# EAGLE design smarty09 (EAGLE 6.5.0)
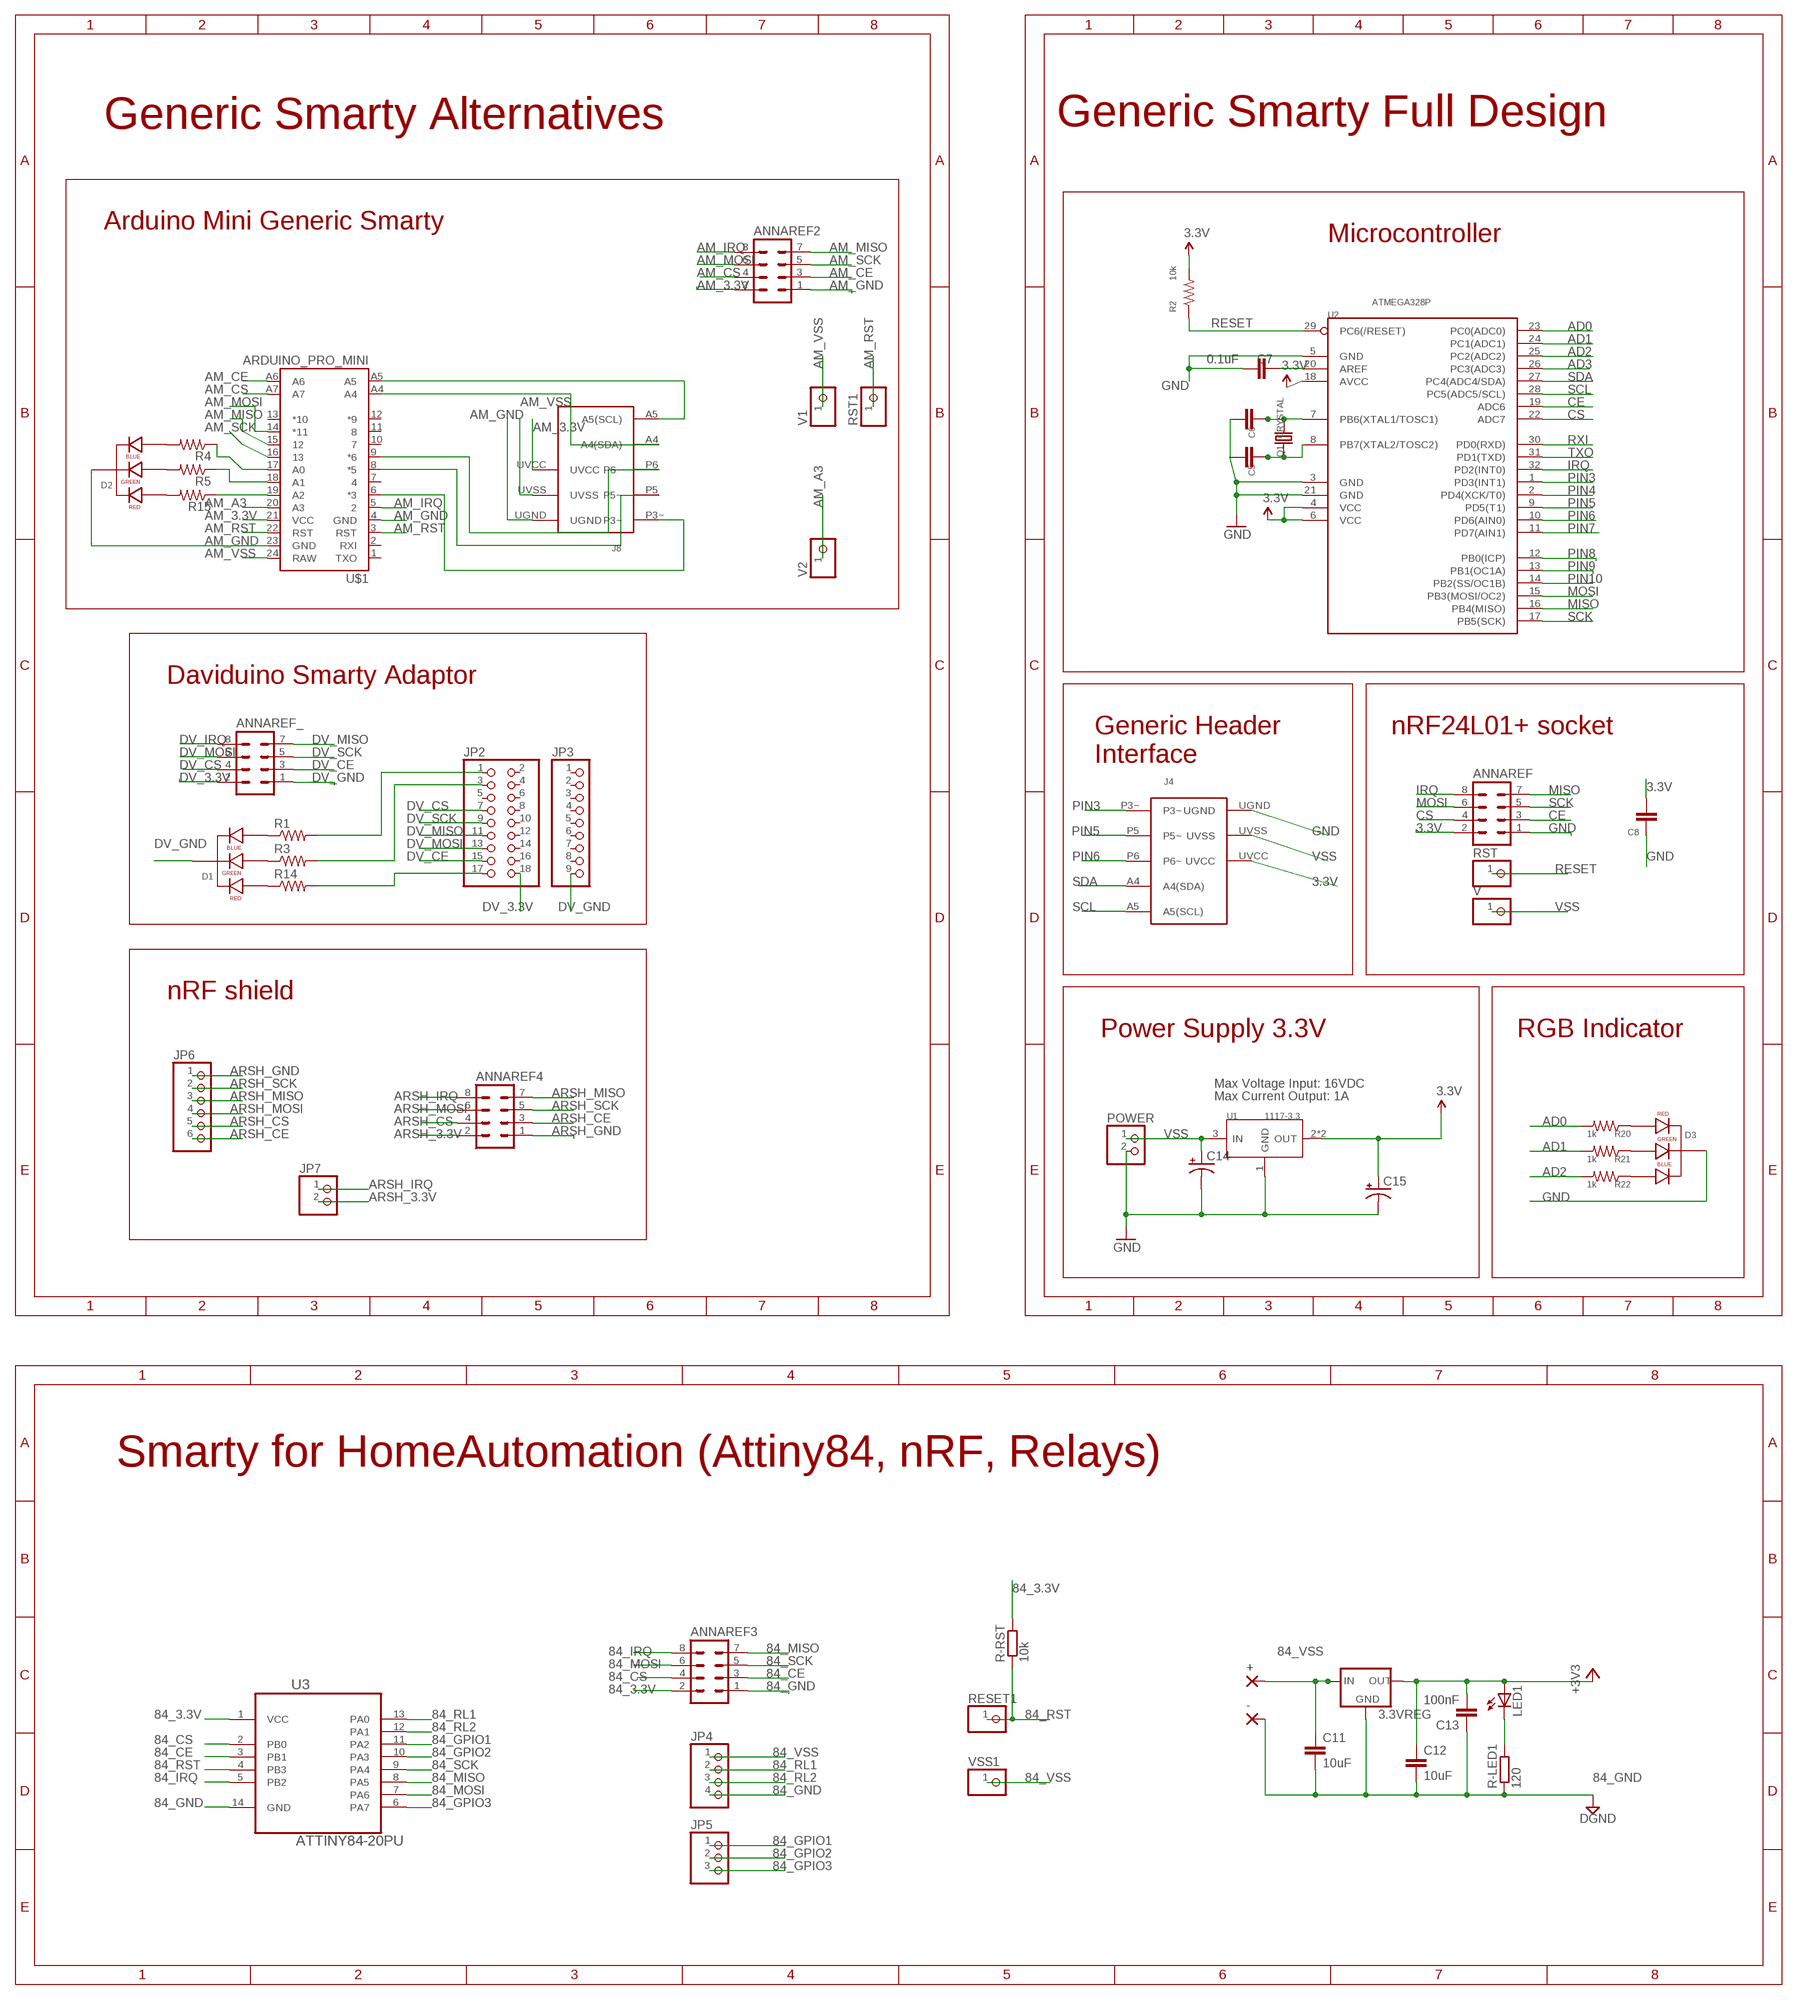
[diagram p0: schematic, sheet 1, part 1 of 2]
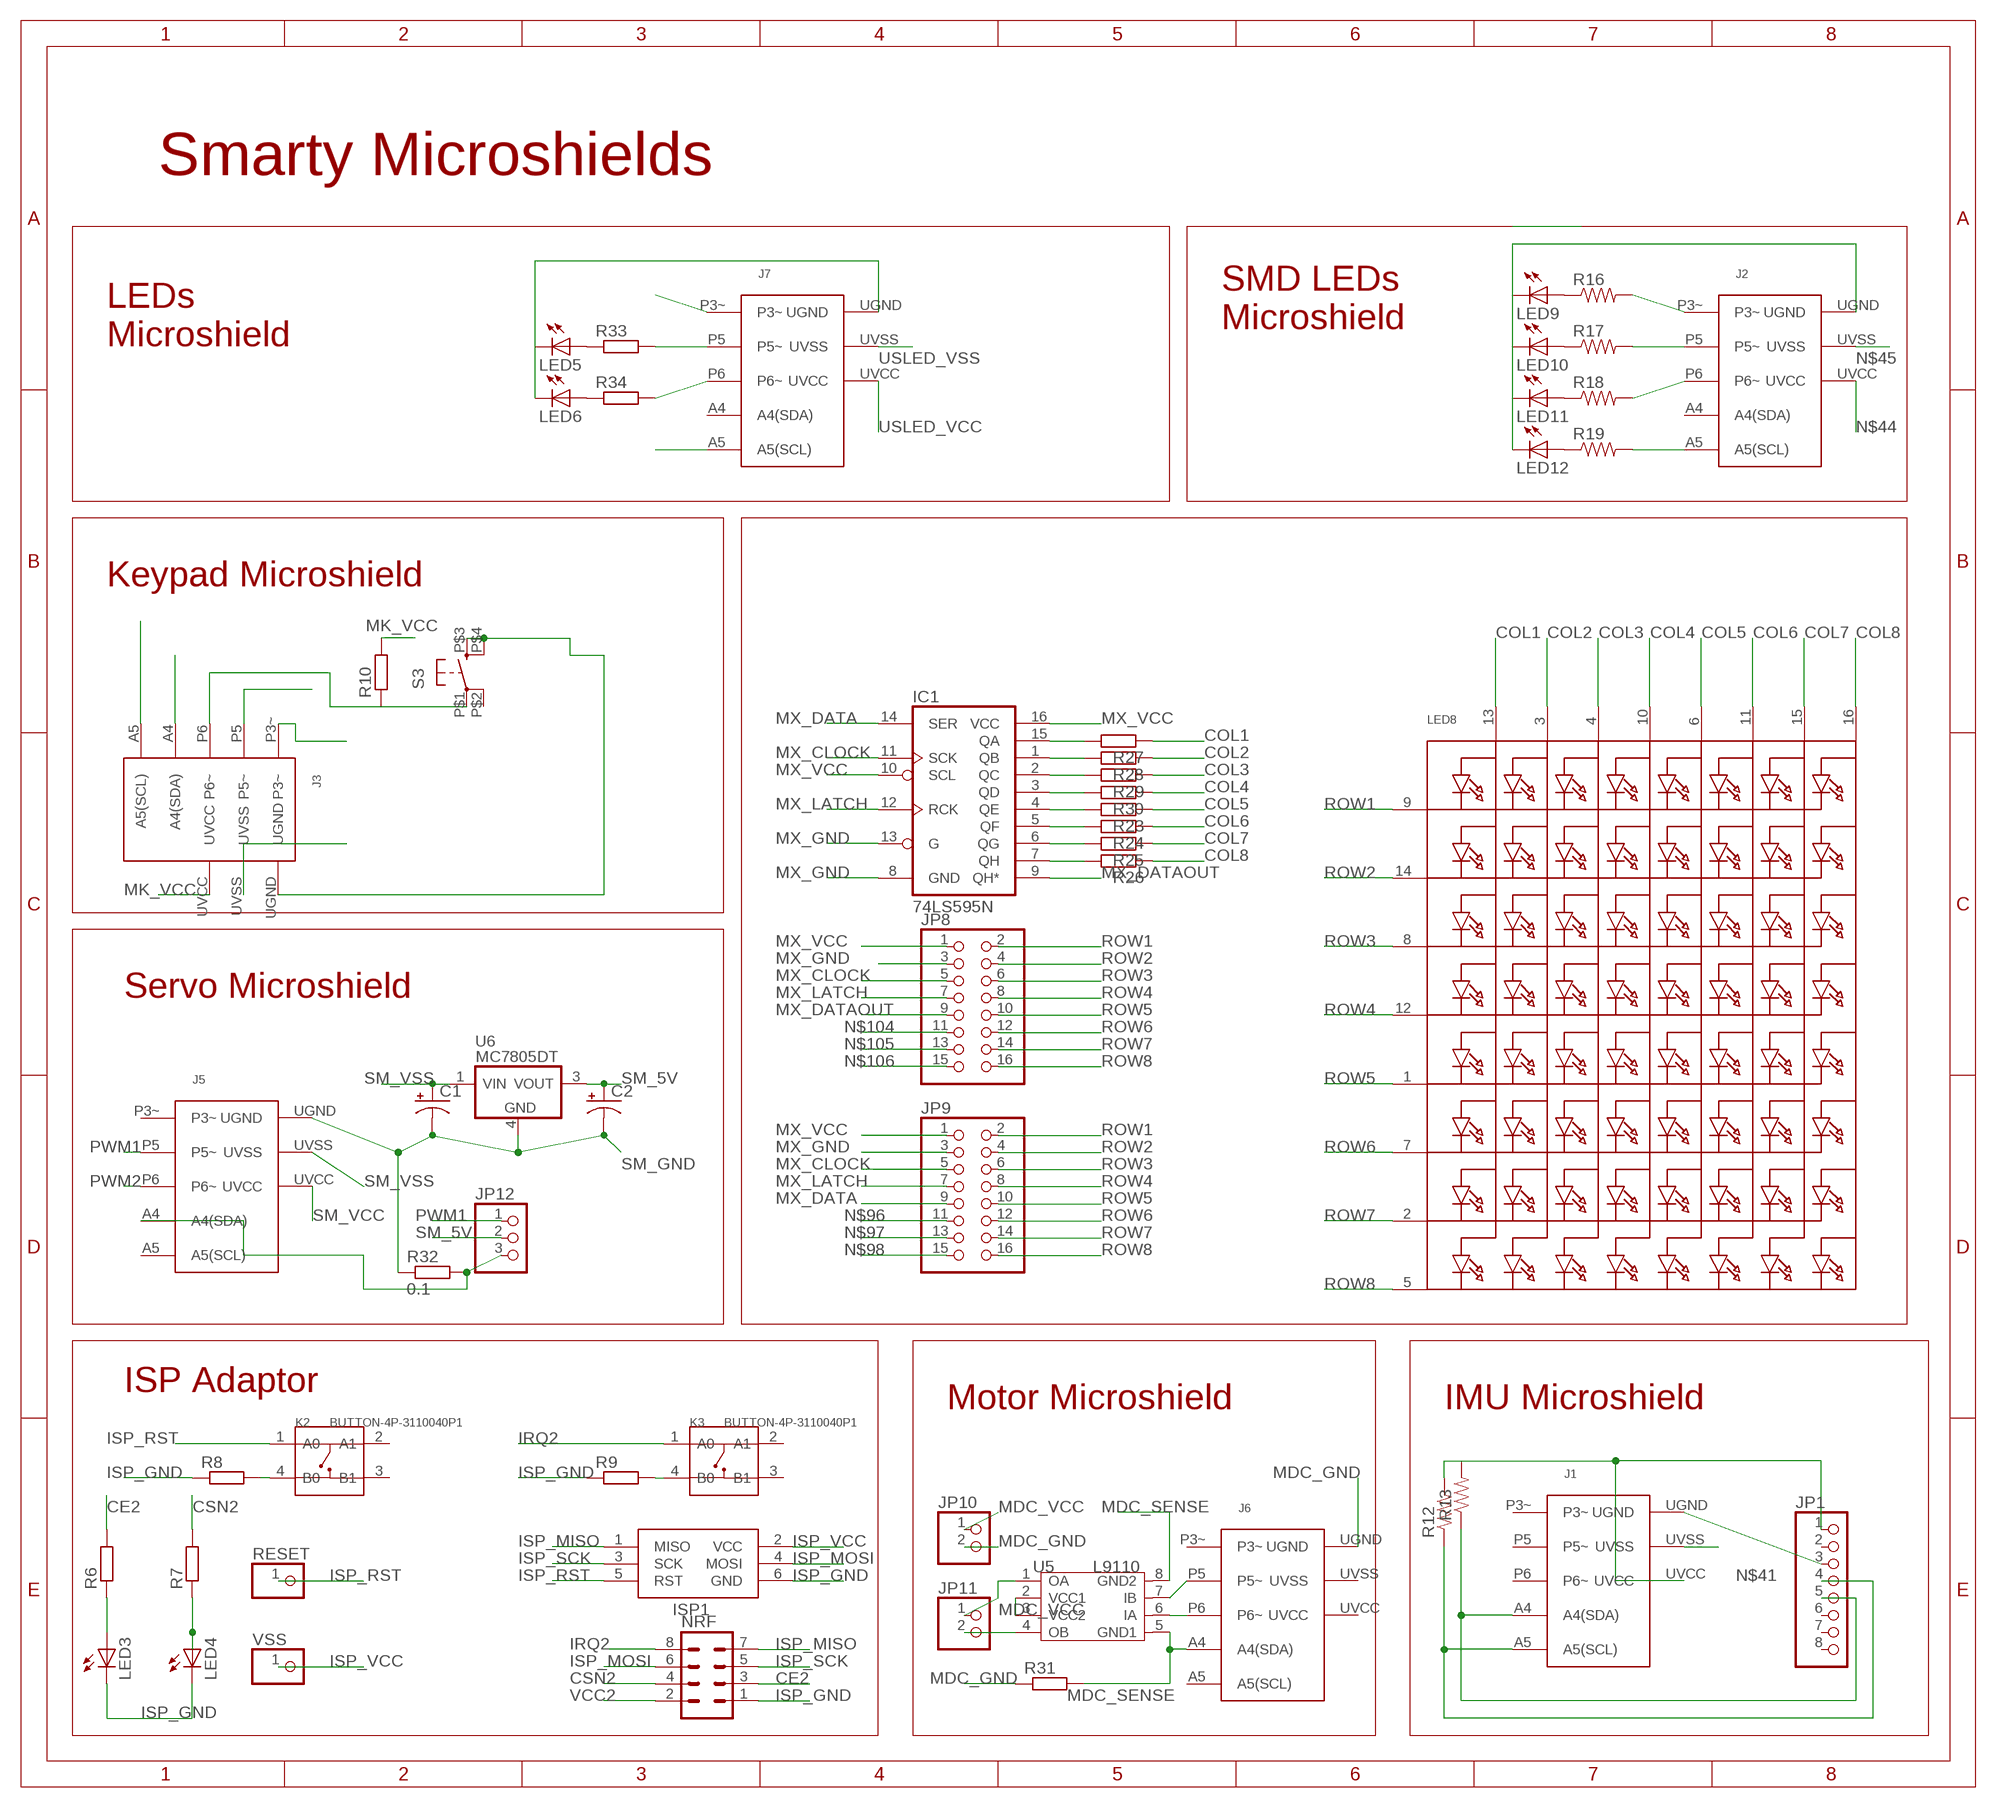
[diagram p1: schematic, sheet 1, part 2 of 2]

## Parts
3.3VREG  78LXX  [78LXX]
+  2,54/1,1  [2,54/1,1]
-  2,54/1,1  [2,54/1,1]
ANNAREF  MA04-2  [MA04-2]
ANNAREF2  MA04-2  [MA04-2]
ANNAREF3  MA04-2  [MA04-2]
ANNAREF4  MA04-2  [MA04-2]
ANNAREF_  MA04-2  [MA04-2]
C1  CAP_POL6032  [EIA6032]
C2  CAP_POL6032  [EIA6032]
C5  CAP1206  [1206]
C6  CAP1206  [1206]
C7  0.1uF  CAP1206  [1206]
C8  CAP1206  [1206]
C11  10uF  C-EU025-050X050  [C025-050X050]
C12  10uF  C-EU025-050X050  [C025-050X050]
C13  100nF  C-EU050-024X044  [C050-024X044]
C14  CAP_POL6032  [EIA6032]
C15  CAP_POL6032  [EIA6032]
D1  LED-RGB-CC-THRUCLEAR  [LED-RGB-THRU]
D2  LED-RGB-CC-THRUCLEAR  [LED-RGB-THRU]
D3  LED-RGB-CC-THRUCLEAR  [LED-RGB-THRU]
IC1  74LS595N  [DIL16]
ISP1  AVRISP-6  [AVRISP]
J1  SMARTY-USHIELD  [SMARTY-USHIELD-2.54]
J2  SMARTY-USHIELD  [SMARTY-USHIELD-2.54]
J3  SMARTY-USHIELD  [SMARTY-USHIELD-2.54]
J4  SMARTY-USHIELD  [SMARTY-USHIELD-2.54]
J5  SMARTY-USHIELD  [SMARTY-USHIELD-2.54]
J6  SMARTY-USHIELD  [SMARTY-USHIELD-2.54]
J7  SMARTY-USHIELD  [SMARTY-USHIELD-2.54]
J8  SMARTY-USHIELD  [SMARTY-USHIELD-2.54]
JP1  PINHD-1X8BIG  [1X08-BIG]
JP2  PINHD-2X9-BIG  [2X09-BIG]
JP3  PINHD-1X9  [1X09-BIG]
JP4  PINHD-1X4  [1X04]
JP5  PINHD-1X3  [1X03]
JP6  PINHD-1X6  [1X06]
JP7  PINHD-1X2  [1X02]
JP8  PINHD-2X8  [2X08]
JP9  PINHD-2X8  [2X08]
JP10  PINHD-1X2  [1X02]
JP11  PINHD-1X2  [1X02]
JP12  PINHD-1X3/90  [1X03/90]
K2  BUTTON-4P-3110040P1  [4P-6.0X6.0X5.0H]
K3  BUTTON-4P-3110040P1  [4P-6.0X6.0X5.0H]
LED1  LED3MM  [LED3MM]
LED3  LED3MM  [LED3MM]
LED4  LED3MM  [LED3MM]
LED5  LED3MM  [LED3MM]
LED6  LED3MM  [LED3MM]
LED8  SEGMENT_8X8_ROWCATHODEM12A881UR  [SEGMENT_BL-M12A881UR]
LED9  LEDCHIPLED_1206  [CHIPLED_1206]
LED10  LEDCHIPLED_1206  [CHIPLED_1206]
LED11  LEDCHIPLED_1206  [CHIPLED_1206]
LED12  LEDCHIPLED_1206  [CHIPLED_1206]
NRF  MA04-2  [MA04-2]
POWER  PINHD-1X2  [1X02]
Q1  CRYSTAL  CRYSTAL-0500290P1  [2P-SMD-5.0X3.2]
R1  R-US_0204/2V  [0204V]
R2  10k  RESISTOR1206  [1206]
R3  R-US_0204/2V  [0204V]
R4  R-US_0207/2V  [0207/2V]
R5  R-US_0207/2V  [0207/2V]
R6  R-EU_0204/2V  [0204V]
R7  R-EU_0204/2V  [0204V]
R8  R-EU_0204/2V  [0204V]
R9  R-EU_0204/2V  [0204V]
R10  R-EU_0204/7  [0204/7]
R12  RESISTOR1206  [1206]
R13  RESISTOR1206  [1206]
R14  R-US_0204/2V  [0204V]
R15  R-US_0207/2V  [0207/2V]
R16  RESISTOR1206  [1206]
R17  RESISTOR1206  [1206]
R18  RESISTOR1206  [1206]
R19  RESISTOR1206  [1206]
R20  1k  RESISTOR1206  [1206]
R21  1k  RESISTOR1206  [1206]
R22  1k  RESISTOR1206  [1206]
R23  R-EU_0204/2V  [0204V]
R24  R-EU_0204/2V  [0204V]
R25  R-EU_0204/2V  [0204V]
R26  R-EU_0204/2V  [0204V]
R27  R-EU_0204/2V  [0204V]
R28  R-EU_0204/2V  [0204V]
R29  R-EU_0204/7  [0204/7]
R30  R-EU_0204/2V  [0204V]
R31  R-EU_R1206  [R1206]
R32  0.1  R-EU_R1206  [R1206]
R33  R-EU_0207/2V  [0207/2V]
R34  R-EU_0207/2V  [0207/2V]
R-LED1  120  R-EU_0204/2V  [0204V]
R-RST  10k  R-EU_0204/2V  [0204V]
RESET  PINHD-1X1  [1X01]
RESET1  PINHD-1X1  [1X01]
RST  PINHD-1X1  [1X01]
RST1  PINHD-1X1  [1X01]
S3  TAC_SWITCHKSA_SEALED  [KSA_SEALED_TAC_SWITCH]
U1  1117-3.3  CJ1117-3.3-1310120P1  [SOT89]
U2  ATMEGA328P  ATMEGA328P-AU-1030060P1  [TQFP32]
U3  ATTINY84-20PU  [DIP254P762X533-14]
U5  L9110  L9110-SOIC8  [SOIC8]
U6  MC7805DT  [DPAK-3]
U$1  ARDUINO_PRO_MINI  [ARDUINO_PRO_MINI]
V  PINHD-1X1  [1X01]
V1  PINHD-1X1  [1X01]
V2  PINHD-1X1  [1X01]
VSS  PINHD-1X1  [1X01]
VSS1  PINHD-1X1  [1X01]

## Nets
3.3V [power]: ANNAREF.2 C8.1 C15.P$1(+) J4.UVCC R2.2 U1.2(OUT) U1.4(OUT) U2.4(VCC) U2.6(VCC) U2.18(AVCC)
84_3.3V [power]: 3.3VREG.OUT ANNAREF3.2 C12.1 C13.2 LED1.A R-RST.2 U3.1(VCC) ; supply symbol labelled +3V3
84_CE: ANNAREF3.3 U3.3(PB1)
84_CS: ANNAREF3.4 U3.2(PB0)
84_GND [power]: 3.3VREG.GND -.1(P) ANNAREF3.1 C11.2 C12.2 C13.1 JP4.4 R-LED1.1 U3.14(GND) ; supply symbol labelled DGND
84_GPIO1: JP5.1 U3.11(PA2)
84_GPIO2: JP5.2 U3.10(PA3)
84_GPIO3: JP5.3 U3.6(PA7)
84_IRQ: ANNAREF3.8 U3.5(PB2)
84_MISO: ANNAREF3.7 U3.8(PA5)
84_MOSI: ANNAREF3.6 U3.7(PA6)
84_RL1: JP4.2 U3.13(PA0)
84_RL2: JP4.3 U3.12(PA1)
84_RST: R-RST.1 RESET1.1 U3.4(PB3)
84_SCK: ANNAREF3.5 U3.9(PA4)
84_VSS: 3.3VREG.IN +.1(P) C11.1 JP4.1 VSS1.1
AD0: R20.2 U2.23(PC0(ADC0))
AD1: R21.2 U2.24(PC1(ADC1))
AD2: R22.2 U2.25(PC2(ADC2))
AD3: U2.26(PC3(ADC3))
AM_3.3V [power]: ANNAREF2.2 J8.UVCC U$1.21(VCC)
AM_A3: U$1.20(A3) V2.1
AM_CE: ANNAREF2.3 U$1.A6
AM_CS: ANNAREF2.4 U$1.A7
AM_GND [power]: ANNAREF2.1 D2.2(CATHODE) J8.UGND U$1.4(GND) U$1.23(GND)
AM_IRQ: ANNAREF2.8 U$1.5
AM_MISO: ANNAREF2.7 U$1.15
AM_MOSI: ANNAREF2.6 U$1.14(*11)
AM_RST: RST1.1 U$1.3(RST) U$1.22(RST)
AM_SCK: ANNAREF2.5 U$1.16
AM_VSS [power]: J8.UVSS U$1.24(RAW) V1.1
ARSH_3.3V [power]: ANNAREF4.2 JP7.2
ARSH_CE: ANNAREF4.3 JP6.6
ARSH_CS: ANNAREF4.4 JP6.5
ARSH_GND [power]: ANNAREF4.1 JP6.1
ARSH_IRQ: ANNAREF4.8 JP7.1
ARSH_MISO: ANNAREF4.7 JP6.3
ARSH_MOSI: ANNAREF4.6 JP6.4
ARSH_SCK: ANNAREF4.5 JP6.2
CE: ANNAREF.3 U2.19(ADC6)
CE2: NRF.3 R6.2
COL1: LED8.13(A1) R27.1
COL2: LED8.3(A2) R28.1
COL3: LED8.4(A3) R29.1
COL4: LED8.10(A4) R30.1
COL5: LED8.6(A5) R23.1
COL6: LED8.11(A6) R24.1
COL7: LED8.15(A7) R25.1
COL8: LED8.16(A8) R26.1
CS: ANNAREF.4 U2.22(ADC7)
CSN2: NRF.4 R7.2
DV_3.3V [power]: ANNAREF_.2 JP2.18
DV_CE: ANNAREF_.3 JP2.15
DV_CS: ANNAREF_.4 JP2.7
DV_GND [power]: ANNAREF_.1 D1.2(CATHODE) JP3.9
DV_IRQ: ANNAREF_.8
DV_MISO: ANNAREF_.7 JP2.11
DV_MOSI: ANNAREF_.6 JP2.13
DV_SCK: ANNAREF_.5 JP2.9
GND [power]: ANNAREF.1 C5.1 C6.1 C7.2 C8.2 C14.P$2(-) C15.P$2(-) D3.2(CATHODE) J4.UGND POWER.2 U1.1(GND) U2.3(GND) U2.5(GND) U2.21(GND)
IA: J6.P6(P6~) U5.6(IA)
IB: J6.P5(P5~) U5.7(IB)
IRQ: ANNAREF.8 U2.32(PD2(INT0))
IRQ2: K3.1(A0) NRF.8
ISP_GND: ISP1.6(GND) LED3.K(C) LED4.K(C) NRF.1 R8.1 R9.1
ISP_MISO: ISP1.1(MISO) NRF.7
ISP_MOSI: ISP1.4(MOSI) NRF.6
ISP_RST: ISP1.5(RST) K2.1(A0) RESET.1
ISP_SCK: ISP1.3(SCK) NRF.5
ISP_VCC: ISP1.2(VCC) VSS.1
LD1: J2.P3~ R16.2
LD2: J2.P5(P5~) R17.2
LD3: J2.P6(P6~) R18.2
LD4: J7.P3~
LD5: J7.P5(P5~) R33.2
LD6: J7.P6(P6~) R34.2
MDC_GND: J6.UGND JP10.2 R31.1
MDC_SENSE: J6.A4(A4(SDA)) R31.2 U5.5(GND1) U5.8(GND2)
MDC_VCC: JP10.1 U5.2(VCC1) U5.3(VCC2)
MISO: ANNAREF.7 U2.16(PB4(MISO))
MK_VCC: J3.UVCC R10.2
MOSI: ANNAREF.6 U2.15(PB3(MOSI/OC2))
MX_CLOCK: IC1.11(SCK) JP8.5 JP9.5
MX_DATA: IC1.14(SER) JP9.9
MX_DATAOUT: IC1.9(QH*) JP8.9
MX_GND: IC1.8(GND) IC1.13(G) JP8.3 JP9.3
MX_LATCH: IC1.12(RCK) JP8.7 JP9.7
MX_VCC: IC1.10(SCL) IC1.16(VCC) JP8.1 JP9.1
N$1: C7.1 U2.20(AREF)
N$2: C6.2 Q1.2 U2.7(PB6(XTAL1/TOSC1))
N$3: JP11.1 U5.1(OA)
N$4: C5.2 Q1.1 U2.8(PB7(XTAL2/TOSC2))
N$5: JP11.2 U5.4(OB)
N$6: J8.A4(A4(SDA)) U$1.A4
N$7: J8.A5(A5(SCL)) U$1.A5
N$8: K3.4(B0) R9.2
N$9: K2.4(B0) R8.2
N$10: LED3.A R6.1
N$11: LED4.A R7.1
N$12: D1.4(BLUE_CATHODE) R1.1
N$13: D1.3(GREEN_CATHODE) R3.1
N$14: D1.1(RED_CATHODE) R14.1
N$15: JP2.17 R14.2
N$16: J3.P6(P6~) R10.1 S3.P$1
N$17: J3.P5(P5~)
N$18: J3.UGND S3.P$3 S3.P$4
N$19: J1.UVCC JP1.1 R12.2 R13.2
N$20: J1.UGND JP1.3
N$21: J1.A5(A5(SCL)) JP1.4 R12.1
N$22: J1.A4(A4(SDA)) JP1.5 R13.1
N$23: D2.4(BLUE_CATHODE) R4.2
N$24: R4.1 U$1.17(A0)
N$25: D2.3(GREEN_CATHODE) R5.2
N$26: JP2.3 R3.2
N$27: JP2.1 R1.2
N$29: IC1.15(QA) R27.2
N$30: IC1.1(QB) R28.2
N$31: IC1.2(QC) R29.2
N$32: J8.P6(P6~) U$1.9(*6)
N$33: J8.P5(P5~) U$1.8(*5)
N$34: IC1.3(QD) R30.2
N$35: J8.P3~ U$1.6(*3)
N$36: IC1.4(QE) R23.2
N$37: IC1.5(QF) R24.2
N$38: IC1.6(QG) R25.2
N$39: R5.1 U$1.18(A1)
N$40: D2.1(RED_CATHODE) R15.2
N$41: J1.UVSS
N$42: D3.1(RED_CATHODE) R20.1
N$43: J2.A5(A5(SCL)) R19.2
N$44: J2.UVCC
N$45: J2.UVSS
N$46: J3.P3~
N$47: IC1.7(QH) R26.2
N$48: J3.UVSS
N$50: R15.1 U$1.19(A2)
N$51: LED1.K(C) R-LED1.2
N$53: J3.A4(A4(SDA))
N$54: J3.A5(A5(SCL))
N$56: LED5.A R33.1
N$57: LED6.A R34.1
N$60: J7.A5(A5(SCL))
N$62: LED9.A R16.1
N$63: LED10.A R17.1
N$64: LED11.A R18.1
N$65: LED12.A R19.1
N$66: D3.3(GREEN_CATHODE) R21.1
N$67: D3.4(BLUE_CATHODE) R22.1
N$68: J2.UGND LED9.C LED10.C LED11.C LED12.C
N$77: J5.A4(A4(SDA)) JP12.3 R32.2
N$96: JP9.11
N$97: JP9.13
N$98: JP9.15
N$104: JP8.11
N$105: JP8.13
N$106: JP8.15
PIN3: J4.P3~ U2.1(PD3(INT1))
PIN4: U2.2(PD4(XCK/T0))
PIN5: J4.P5(P5~) U2.9(PD5(T1))
PIN6: J4.P6(P6~) U2.10(PD6(AIN0))
PIN7: U2.11(PD7(AIN1))
PIN8: U2.12(PB0(ICP))
PIN9: U2.13(PB1(OC1A))
PIN10: U2.14(PB2(SS/OC1B))
PWM1: J5.P5(P5~) JP12.1
PWM2: J5.P6(P6~)
RESET: R2.1 RST.1 U2.29(PC6(/RESET))
ROW1: JP8.2 JP9.2 LED8.9(K1)
ROW2: JP8.4 JP9.4 LED8.14(K2)
ROW3: JP8.6 JP9.6 LED8.8(K3)
ROW4: JP8.8 JP9.8 LED8.12(K4)
ROW5: JP8.10 JP9.10 LED8.1(K5)
ROW6: JP8.12 JP9.12 LED8.7(K6)
ROW7: JP8.14 JP9.14 LED8.2(K7)
ROW8: JP8.16 JP9.16 LED8.5(K8)
RXI: U2.30(PD0(RXD))
SCK: ANNAREF.5 U2.17(PB5(SCK))
SCL: J4.A5(A5(SCL)) U2.28(PC5(ADC5/SCL))
SDA: J4.A4(A4(SDA)) U2.27(PC4(ADC4/SDA))
SM_5V: C2.P$1(+) JP12.2 U6.3(VOUT)
SM_GND: C1.P$2(-) C2.P$2(-) J5.UGND R32.1 U6.4(GND)
SM_VCC: J5.UVCC
SM_VSS [power]: C1.P$1(+) J5.UVSS U6.1(VIN)
TXO: U2.31(PD1(TXD))
USLED_GND: J7.UGND LED5.K(C) LED6.K(C)
USLED_VCC: J7.UVCC
USLED_VSS: J7.UVSS
VCC2: NRF.2
VSS [power]: C14.P$1(+) J4.UVSS POWER.1 U1.3(IN) V.1
Unconnected: J1.P3~ J1.P5(P5~) J1.P6(P6~) J2.A4(A4(SDA)) J5.A5(A5(SCL)) J5.P3~ J6.A5(A5(SCL)) J6.P3~ J7.A4(A4(SDA)) JP1.2 JP1.6 JP1.7 JP1.8 JP2.2 JP2.4 JP2.5 JP2.6 JP2.8 JP2.10 JP2.12 JP2.14 JP2.16 JP3.1 JP3.2 JP3.3 JP3.4 JP3.5 JP3.6 JP3.7 JP3.8 K2.2(A1) K2.3(B1) K3.2(A1) K3.3(B1) S3.P$2 U$1.1(TXO) U$1.2(RXI) U$1.7 U$1.10 U$1.11 U$1.12(*9) U$1.13(*10)

## Notes on the sheet
- Generic Smarty Alternatives | Generic Smarty Full Design | Smarty Microshields
- Arduino Mini Generic Smarty
- Microcontroller
- SMD LEDs
  Microshield
- LEDs
  Microshield
- Keypad Microshield
- Daviduino Smarty Adaptor
- nRF24L01+ socket | Servo Microshield
- Generic Header
  Interface
- nRF shield
- ISP Adaptor
- Power Supply 3.3V | RGB Indicator | Motor Microshield | IMU Microshield
- Max Voltage Input: 16VDC
- Max Current Output: 1A
- Smarty for HomeAutomation (Attiny84, nRF, Relays)

## Power pins joined to a net without a drawn wire
UVCC: J6.UVCC
UVSS: J6.UVSS

## Library data of the parts
3.3VREG = v-reg:78LXX: VOLTAGE REGULATOR
+ - = wirepad:2,54/1,1: THROUGH-HOLE PAD
ANNAREF ANNAREF2-ANNAREF4 ANNAREF_ NRF = con-lstb:MA04-2: PIN HEADER; OC_FARNELL: unknown; OC_NEWARK: unknown
C1 C2 C14 C15 = SparkFun-Passives:CAP_POL: Capacitor Polarized These are standard SMD and PTH capacitors. Normally 10uF, 47uF, and 100uF in electrolytic and tantalum varieties. Always verify the external diameter of the through hole cap, it varies with capacity, voltage, and manufacturer. The EIA devices should be standard.
C5-C8 = SparkFun-Passives:CAP: Capacitor Standard 0603 ceramic capacitor, and 0.1" leaded capacitor.
C11-C13 = rcl:C-EU: CAPACITOR, European symbol
D1-D3 = smarties:LED-RGB-CC-THRU: RGB Through-hole common cathode LED SparkFun Storefront: COM-00105 (Clear) COM-09264 (Diffuse); PROD_ID: DIO-08418
IC1 = SparkFun-DigitalIC:74*595: 8-bit SHIFT REGISTER, output latch
ISP1 = adafruit:AVRISP: AVR ISP HEADER Standard 6 pin header for AVR programming
J1-J8 = smarties:SMARTY-USHIELD: Smarty uShield Header (0.1") This is a pin header with 0.1" (2.54 mm) standard pin steps for Smarty micro-shields. Design : David Lyszyk
JP1 = adafruit:PINHD-1X8: PIN HEADER
JP2 = adafruit:PINHD-2X9: PIN HEADER With larger annulars
JP3 = adafruit:PINHD-1X9: Pin header 1x10 0.1" spacing With round pins
JP4 = pinhead:PINHD-1X4: PIN HEADER
JP5 JP12 = pinhead:PINHD-1X3: PIN HEADER
JP6 = pinhead:PINHD-1X6: PIN HEADER
JP7 JP10 JP11 POWER = pinhead:PINHD-1X2: PIN HEADER
JP8 JP9 = pinhead:PINHD-2X8: PIN HEADER
K2 K3 = OPL:BUTTON-4P
LED1 LED3-LED6 LED9-LED12 = led:LED: LED OSRAM: - CHIPLED LG R971, LG N971, LY N971, LG Q971, LY Q971, LO R971, LY R971 LH N974, LH R974 LS Q976, LO Q976, LY Q976 LO Q996 - Hyper CHIPLED LW Q18S LB Q993, LB Q99A, LB R99A - SideLED LS A670, LO A670, LY A670, LG A670, LP A670 LB A673, LV A673, LT A673, LW A673 LH A674 LY A675 LS A676, LA A676, LO A676, LY A676, LW A676 LS A679, LY A679, LG A679 - Hyper Micro SIDELED® LS Y876, LA Y876, LO Y876, LY Y876 LT Y87S - SmartLED LW L88C, LW L88S LB L89C, LB L89S, LG L890 LS L89K, LO L89K, LY L89K LS L896, LA L896, LO L896, LY L896 - TOPLED LS T670, LO T670, LY T670, LG T670, LP T670 LSG T670, LSP T670, LSY T670, LOP T670, LYG T670 LG T671, LOG T671, LSG T671 LB T673, LV T673, LT T673, LW T673 LH T674 LS T676, LA T676, LO T676, LY T676, LB T676, LH T676, LSB T676, LW T676 LB T67C, LV T67C, LT T67C, LS T67K, LO T67K, LY T67K, LW E67C LS E67B, LA E67B, LO E67B, LY E67B, LB E67C, LV E67C, LT E67C LW T67C LS T679, LY T679, LG T679 LS T770, LO T770, LY T770, LG T770, LP T770 LB T773, LV T773, LT T773, LW T773 LH T774 LS E675, LA E675, LY E675, LS T675 LS T776, LA T776, LO T776, LY T776, LB T776 LHGB T686 LT T68C, LB T68C - Hyper Mini TOPLED® LB M676 - Mini TOPLED Santana® LG M470 LS M47K, LO M47K, LY M47K Source: http://www.osram.convergy.de LUXEON: - LUMILED® LXK2-PW12-R00, LXK2-PW12-S00, LXK2-PW14-U00, LXK2-PW14-V00 LXK2-PM12-R00, LXK2-PM12-S00, LXK2-PM14-U00 LXK2-PE12-Q00, LXK2-PE12-R00, LXK2-PE12-S00, LXK2-PE14-T00, LXK2-PE14-U00 LXK2-PB12-K00, LXK2-PB12-L00, LXK2-PB12-M00, LXK2-PB14-N00, LXK2-PB14-P00, LXK2-PB14-Q00 LXK2-PR12-L00, LXK2-PR12-M00, LXK2-PR14-Q00, LXK2-PR14-R00 LXK2-PD12-Q00, LXK2-PD12-R00, LXK2-PD12-S00 LXK2-PH12-R00, LXK2-PH12-S00 LXK2-PL12-P00, LXK2-PL12-Q00, LXK2-PL12-R00 Source: www.luxeon.com KINGBRIGHT: KA-3528ASYC Source: www.kingbright.com
LED8 = smarties:SEGMENT_8X8_ROWCATHODE: 8x8 LED Segment Displays: Row = Cathode 0.7" Red 8X8 Matrix, 1.9mm Round LEDs - BL-M07C881UR 1.2" Red 8x8 Matrix, 3.0mm Round LEDs - BL-M12A881UR 1.2" Red 8x8 Matrix, 3.0mm Square LEDs - BL-M12A883
Q1 = OPL:CRYSTAL*
R1 R3-R5 R14 R15 = resistor:R-US_: RESISTOR, American symbol
R2 R12 R13 R16-R22 = SparkFun-Passives:RESISTOR: Resistor Basic schematic elements and footprints for 0603, 1206, and PTH resistors.
R6-R9 = rcl:R-EU_: RESISTOR, European symbol
R10 R23-R34 R-LED1 R-RST = resistor:R-EU_: RESISTOR, European symbol
RESET RESET1 RST RST1 V V1 V2 VSS VSS1 = pinhead:PINHD-1X1: PIN HEADER
S3 = SparkFun-Electromechanical:TAC_SWITCH: Momentary Switch Button commonly used for reset or general input. Spark Fun Electronics SKU : COM-00097 SMT- SWCH-08247
U1 = OPL:CJ1117-3.3: 1A Low Dropout Linear Regulator
U2 = OPL:ATMEGA328P-AU: 8-bit AVR Microcontroller with 32K Bytes In-System Programmable Flash
U3 = Atmel_By_element14_Batch_1-00:ATTINY84-20PU: 8-bit Microcontroller with In-System Programmable Flash; MPN: ATTINY84-20PU; OC_FARNELL: -; OC_NEWARK: 58M3794; PACKAGE: PDIP-14; SUPPLIER: Atmel
U5 = con-1.0mm:L9110: Motor Driver
U6 = _hhn_78xx_79xx_NCV78xx_d2pak_dpak:MC78*: 78xx SMD (D2PAK, DPAK) (MC)78xx..DT (DPAK-3; Rth,JA = 92 K/W) (MC)78xx..D2T (D2PAK-3; Rth,JA = 45 K/W @ 10x10mm copper area) Linear Voltage Regulators, Positive, 1 A (ON Semiconductor) Package dimenisions and soldering footprints acc. to ONSEMI specs. Source: http://onsemi.com Datasheet document#: MC7800/D Technologies: 78xxyD(2)Tz: xx = Output Voltage (V) y, z: additional suffixes see manufacturer's datasheet Author: Dipl.-Ing. FH Rainer Bayer HHN Hochschule Heilbronn, rainer.bayer@hs-heilbronn.de Ingenieurbüro ing-rb, mail@ing-rb.de
U$1 = smarties:ARDUINO_PRO_MINI

## Net classes
0 default: width 0.203 mm, drill 0.203 mm, clearance 0.152 mm
1 power: width 0.254 mm, drill 0.406 mm, clearance 0.152 mm
2 thnet: width 0.203 mm, drill 0.203 mm, clearance 0.305 mm

## Board
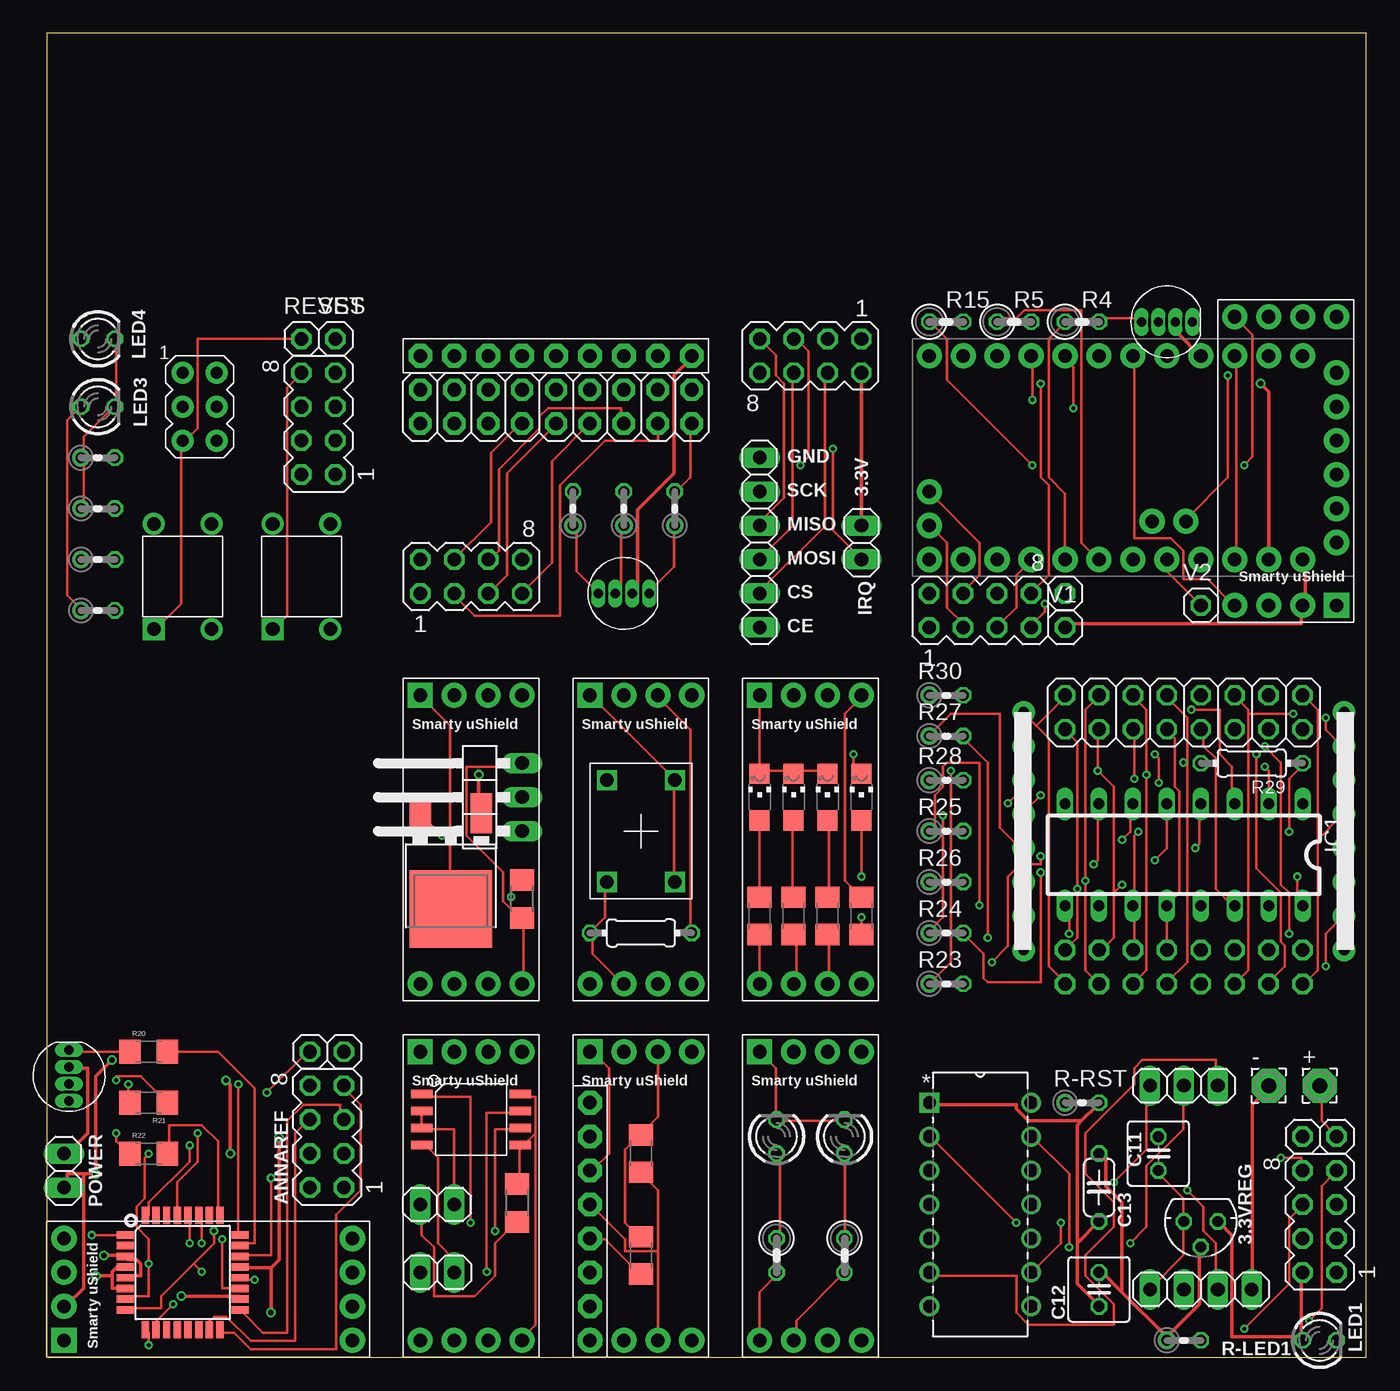
[diagram p2: board, top side]
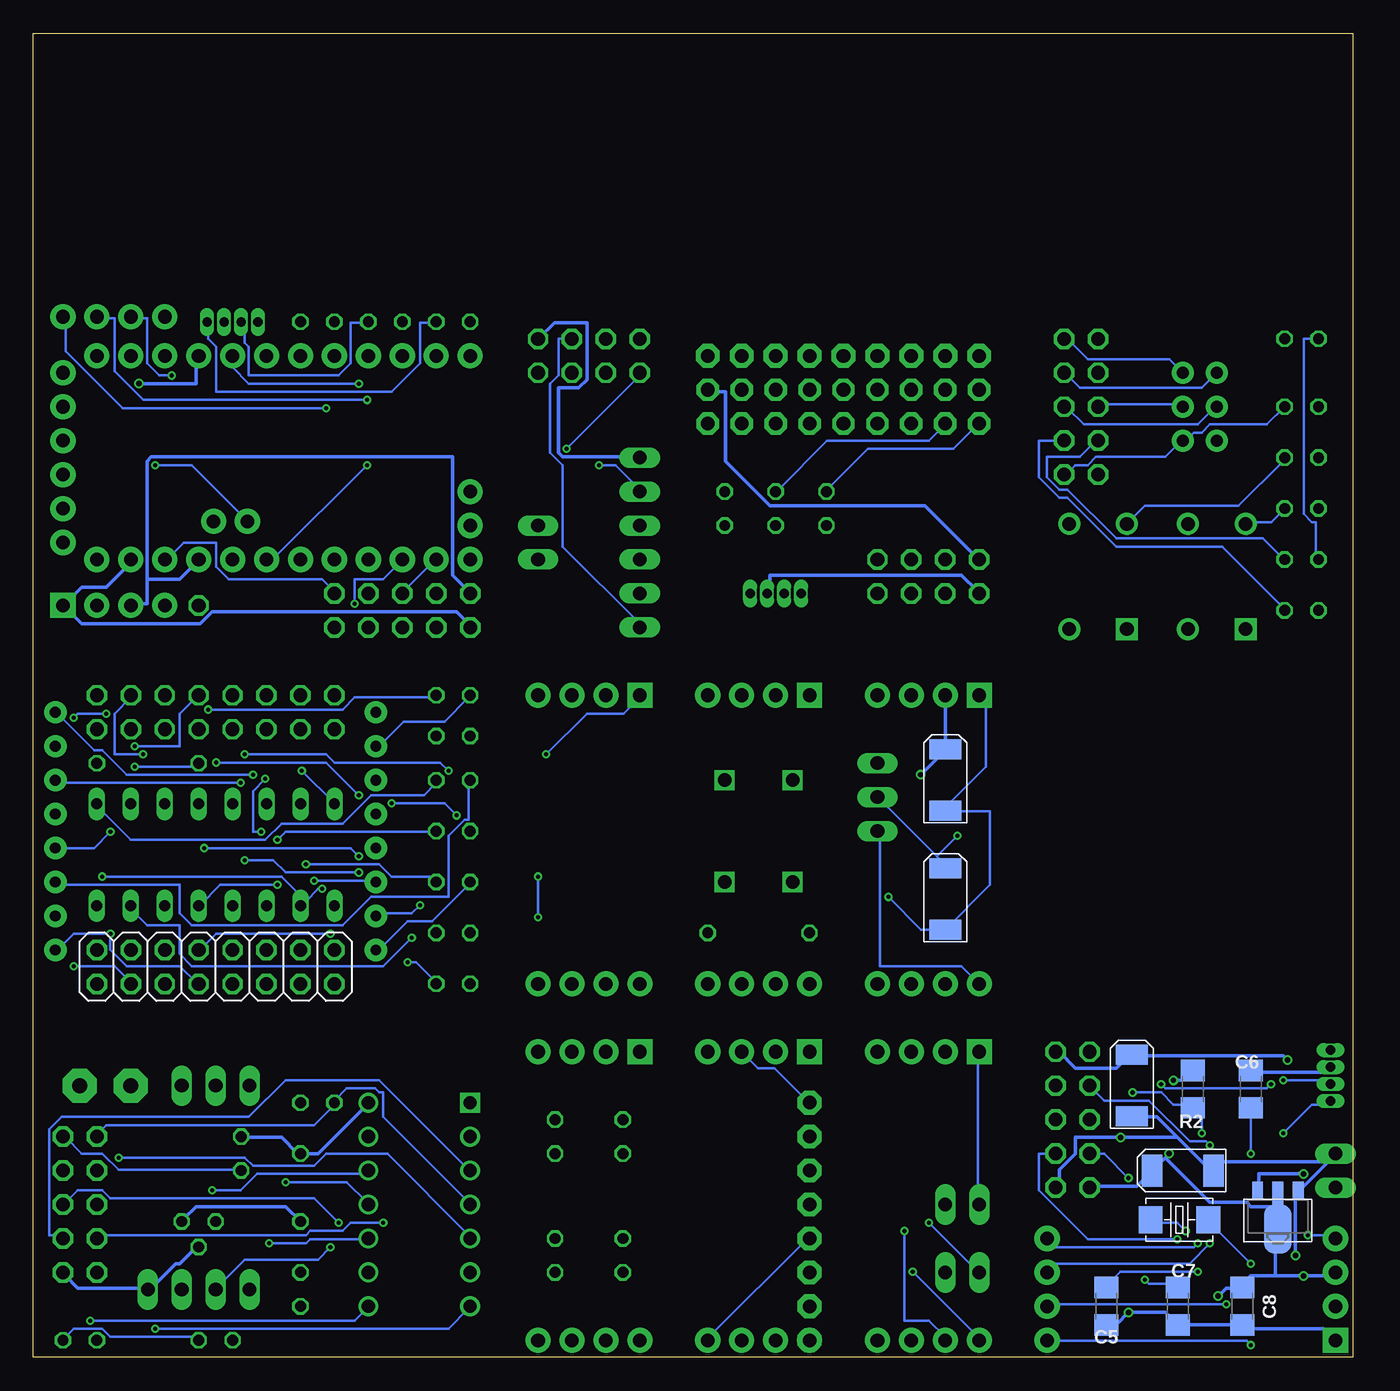
[diagram p3: board, bottom side, seen from below]

Size 98.73 x 99.05 mm. Coordinates in mm from the lower left corner, seen from the top.
Outline: 0,0 98.73,0 98.73,99.05 0,99.05 0,0
Copper layers (1*2*15*16): Top 0.035mm / dielectric 0.2mm / layer 2 0.0175mm / dielectric 1.1mm / layer 15 0.0175mm / dielectric 0.2mm / Bottom 0.035mm
Design rules "SeeedStudio_DRU_no_angle_20130527": minimum track width 6mil, minimum drill 12mil, track to track 6mil, track to pad 6mil, pad to pad 6mil, via to via 6mil, smd to smd 0mil, copper to edge 10mil, drill to drill 10mil, minimum pad ring 6mil, minimum via ring 6mil, stop-mask expansion 2mil, vias tented up to drill 25mil, thermal gap 10mil

### Footprints (pad centres in the part's own frame; a part is rotated, then mirrored left to right if it is on the bottom)
78LXX = drill 0.813 octagon: GND 0,1.905; IN 1.27,0; OUT -1.27,0
2,54/1,1 = drill 1.118 pad 2.54 octagon: 1 0,0
MA04-2 = drill 1.016 octagon: 1 -3.81,-1.27; 2 -3.81,1.27; 3 -1.27,-1.27; 4 -1.27,1.27; 5 1.27,-1.27; 6 1.27,1.27; 7 3.81,-1.27; 8 3.81,1.27
EIA6032 = smd 1.5 x 2.4: P$1 -2.3,0; P$2 2.3,0
1206 = smd 1.6 x 1.8: 1 -1.4,0; 2 1.4,0
C025-050X050 = drill 0.813 octagon: 1 -1.27,0; 2 1.27,0
C050-024X044 = drill 0.813 octagon: 1 -2.54,0; 2 2.54,0
LED-RGB-THRU = drill 0.7 pad 1.016 long: 1 1.905,0; 2 0.635,0; 3 -0.635,0; 4 -1.905,0
DIL16 = drill 0.813 long: 1 -8.89,-3.81; 2 -6.35,-3.81; 3 -3.81,-3.81; 4 -1.27,-3.81; 5 1.27,-3.81; 6 3.81,-3.81; 7 6.35,-3.81; 8 8.89,-3.81; 9 8.89,3.81; 10 6.35,3.81; 11 3.81,3.81; 12 1.27,3.81; 13 -1.27,3.81; 14 -3.81,3.81; 15 -6.35,3.81; 16 -8.89,3.81
AVRISP = drill 0.9 pad 1.626: 1 -1.27,2.54; 2 1.27,2.54; 3 -1.27,0; 4 1.27,0; 5 -1.27,-2.54; 6 1.27,-2.54
SMARTY-USHIELD-2.54 = drill 1.016 pad 1.88: A4 3.81,-11.43; A5 1.27,-11.43; P3~ 3.81,10.16; P5 -3.81,-11.43; P6 -1.27,-11.43; UVCC 1.27,10.16; UVSS -1.27,10.16 | drill 1.016 pad 1.88 square: UGND -3.81,10.16
1X08-BIG = drill 1.016 pad 1.778 octagon: 1 -8.89,0; 2 -6.35,0; 3 -3.81,0; 4 -1.27,0; 5 1.27,0; 6 3.81,0; 7 6.35,0; 8 8.89,0
2X09-BIG = drill 1.016 pad 1.676 octagon: 1 -10.16,-1.27; 2 -10.16,1.27; 3 -7.62,-1.27; 4 -7.62,1.27; 5 -5.08,-1.27; 6 -5.08,1.27; 7 -2.54,-1.27; 8 -2.54,1.27; 9 0,-1.27; 10 0,1.27; 11 2.54,-1.27; 12 2.54,1.27; 13 5.08,-1.27; 14 5.08,1.27; 15 7.62,-1.27; 16 7.62,1.27; 17 10.16,-1.27; 18 10.16,1.27
1X09-BIG = drill 1.016 pad 1.778 octagon: 1 -10.16,0; 2 -7.62,0; 3 -5.08,0; 4 -2.54,0; 5 0,0; 6 2.54,0; 7 5.08,0; 8 7.62,0; 9 10.16,0
1X04 = drill 1.016 long: 1 -3.81,0; 2 -1.27,0; 3 1.27,0; 4 3.81,0
1X03 = drill 1.016 long: 1 -2.54,0; 2 0,0; 3 2.54,0
1X06 = drill 1.016 long: 1 -6.35,0; 2 -3.81,0; 3 -1.27,0; 4 1.27,0; 5 3.81,0; 6 6.35,0
1X02 = drill 1.016 long: 1 -1.27,0; 2 1.27,0
2X08 = drill 1.016 octagon: 1 -8.89,-1.27; 2 -8.89,1.27; 3 -6.35,-1.27; 4 -6.35,1.27; 5 -3.81,-1.27; 6 -3.81,1.27; 7 -1.27,-1.27; 8 -1.27,1.27; 9 1.27,-1.27; 10 1.27,1.27; 11 3.81,-1.27; 12 3.81,1.27; 13 6.35,-1.27; 14 6.35,1.27; 15 8.89,-1.27; 16 8.89,1.27
1X03/90 = drill 1.016 long: 1 -2.54,-3.81; 2 0,-3.81; 3 2.54,-3.81
4P-6.0X6.0X5.0H = drill 1.016 pad 1.651 square: 1 -3.937,2.159 | drill 1.016 pad 1.651: 2 -3.937,-2.159; 3 3.937,-2.159; 4 3.937,2.159
LED3MM = drill 0.813 octagon: A -1.27,0; K 1.27,0
SEGMENT_BL-M12A881UR = drill 0.8 pad 1.676: 1 -8.89,-12; 2 -6.35,-12; 3 -3.81,-12; 4 -1.27,-12; 5 1.27,-12; 6 3.81,-12; 7 6.35,-12; 8 8.89,-12; 9 8.89,12; 10 6.35,12; 11 3.81,12; 12 1.27,12; 13 -1.27,12; 14 -3.81,12; 15 -6.35,12; 16 -8.89,12
CHIPLED_1206 = smd 1.5 x 1.5: A 0,-1.75; C 0,1.75
2P-SMD-5.0X3.2 = smd 1.778 x 2.032: 1 -2.159,0; 2 2.159,0
0204V = drill 0.813 octagon: 1 -1.27,0; 2 1.27,0
0207/2V = drill 0.813 octagon: 1 -1.27,0; 2 1.27,0
0204/7 = drill 0.813 octagon: 1 -3.81,0; 2 3.81,0
R1206 = smd 1.6 x 1.803: 1 -1.422,0; 2 1.422,0
1X01 = drill 1.016 octagon: 1 0,0
KSA_SEALED_TAC_SWITCH = drill 1 square: P$1 -3.81,2.54; P$2 3.81,2.54; P$3 -3.81,-2.54; P$4 3.81,-2.54
SOT89 = smd 0.8 x 1.4: 1 -1.524,-1.905; 3 1.524,-1.905 | smd 0.8 x 1.9: 2 0,-1.651 | smd 2.032 x 3.65: 4 0,0.94
TQFP32 = smd 1.27 x 0.559: 1 -4.293,2.8; 2 -4.293,2; 3 -4.293,1.2; 4 -4.293,0.4; 5 -4.293,-0.4; 6 -4.293,-1.2; 7 -4.293,-2; 8 -4.293,-2.8; 17 4.293,-2.8; 18 4.293,-2; 19 4.293,-1.2; 20 4.293,-0.4; 21 4.293,0.4; 22 4.293,1.2; 23 4.293,2; 24 4.293,2.8 | smd 0.559 x 1.27: 9 -2.8,-4.293; 10 -2,-4.293; 11 -1.2,-4.293; 12 -0.4,-4.293; 13 0.4,-4.293; 14 1.2,-4.293; 15 2,-4.293; 16 2.8,-4.293; 25 2.8,4.293; 26 2,4.293; 27 1.2,4.293; 28 0.4,4.293; 29 -0.4,4.293; 30 -1.2,4.293; 31 -2,4.293; 32 -2.8,4.293
DIP254P762X533-14 = drill 0.991 square: 1 -7.62,15.24 | drill 0.991: 2 -7.62,12.7; 3 -7.62,10.16; 4 -7.62,7.62; 5 -7.62,5.08; 6 -7.62,2.54; 7 -7.62,0; 8 0,0; 9 0,2.54; 10 0,5.08; 11 0,7.62; 12 0,10.16; 13 0,12.7; 14 0,15.24
SOIC8 = smd 0.635 x 1.6: 1 -1.905,-3.683; 2 -0.635,-3.683; 3 0.635,-3.683; 4 1.905,-3.683; 5 1.905,3.683; 6 0.635,3.683; 7 -0.635,3.683; 8 -1.905,3.683
DPAK-3 = smd 1.6 x 3: 1 -2.286,-7.18; 3 2.286,-7.18 | smd 6.2 x 5.8: 4 0,0
ARDUINO_PRO_MINI = drill 1.016 pad 1.88: 1 -7.62,12.7; 2 -7.62,10.16; 3 -7.62,7.62; 4 -7.62,5.08; 5 -7.62,2.54; 6 -7.62,0; 7 -7.62,-2.54; 8 -7.62,-5.08; 9 -7.62,-7.62; 10 -7.62,-10.16; 11 -7.62,-12.7; 12 -7.62,-15.24; 13 7.62,-15.24; 14 7.62,-12.7; 15 7.62,-10.16; 16 7.62,-7.62; 17 7.62,-5.08; 18 7.62,-2.54; 19 7.62,0; 20 7.62,2.54; 21 7.62,5.08; 22 7.62,7.62; 23 7.62,10.16; 24 7.62,12.7; A4 4.763,1.429; A5 4.763,3.969; A6 5.08,-15.24; A7 2.54,-15.24; BLK 6.35,15.24; GND 3.81,15.24; GRN -6.35,15.24; RXI -1.27,15.24; TXO -3.81,15.24; VCC 1.27,15.24

### Placement (x,y rotation side)
3.3VREG  86.36,10.16 180 top
+  95.25,20.32 0 top
-  91.44,20.32 0 top
ANNAREF  20.95,16.51 90 top
ANNAREF2  69.85,55.88 0 top
ANNAREF3  95.25,10.16 90 top
ANNAREF4  57.15,74.93 180 top
ANNAREF_  31.75,58.42 0 top
C1  30.48,43.18 270 bottom
C2  30.48,34.29 270 bottom
C5  18.41,3.81 90 bottom
C6  7.62,20.07 270 bottom
C7  13.08,3.81 270 bottom
C8  8.26,3.81 270 bottom
C11  83.19,15.24 90 top
C12  78.74,5.08 90 top
C13  78.74,12.7 270 top
C14  16.51,20.32 270 bottom
C15  12.7,13.97 0 bottom
D1  43.18,57.15 0 top
D2  83.82,77.47 0 top
D3  1.65,21.08 90 top
IC1  85.09,37.59 180 top
ISP1  11.43,71.12 0 top
J1  44.45,12.7 0 top
J2  57.15,39.37 0 top
J3  44.45,39.37 0 top
J4  11.43,5.08 90 top
J5  31.75,39.37 0 top
J6  31.75,12.7 0 top
J7  57.15,12.7 0 top
J8  92.71,66.42 180 top
JP1  40.64,10.16 270 top
JP2  38.1,71.12 0 top
JP3  38.1,74.93 0 top
JP4  86.36,5.08 0 top
JP5  85.09,20.32 0 top
JP6  53.34,60.96 270 top
JP7  60.96,60.96 90 top
JP8  85.09,29.21 180 bottom
JP9  85.09,48.26 0 top
JP10  29.21,11.43 180 top
JP11  29.21,6.35 0 top
JP12  31.75,41.91 90 top
K2  10.16,58.42 90 top
K3  19.05,58.42 90 top
LED1  95.25,1.27 0 top
LED3  3.81,71.12 0 top
LED4  3.81,76.2 0 top
LED5  54.61,16.51 90 top
LED6  59.69,16.51 90 top
LED8  85.09,39.37 90 top
LED9  60.96,41.91 0 top
LED10  53.34,41.91 0 top
LED11  55.88,41.91 0 top
LED12  58.42,41.91 0 top
NRF  20.32,69.85 90 top
POWER  1.27,13.97 90 top
Q1  12.95,10.29 0 bottom
R1  39.37,63.5 90 top
R2  11.94,20.07 90 bottom
R3  43.18,63.5 90 top
R4  77.47,77.47 0 top
R5  72.39,77.47 0 top
R6  3.81,55.88 0 top
R7  3.81,59.69 0 top
R8  3.81,63.5 0 top
R9  3.81,67.31 0 top
R10  44.45,31.75 0 top
R12  44.45,15.24 90 top
R13  44.45,7.62 90 top
R14  46.99,63.5 90 top
R15  67.31,77.47 0 top
R16  60.96,33.02 90 top
R17  53.34,33.02 270 top
R18  55.88,33.02 270 top
R19  58.42,33.02 270 top
R20  7.62,22.86 0 top
R21  7.62,19.05 180 top
R22  7.62,15.24 0 top
R23  67.31,27.94 0 top
R24  67.31,31.75 0 top
R25  67.31,39.37 0 top
R26  67.31,35.56 0 top
R27  67.31,46.48 0 top
R28  67.31,43.18 0 top
R29  90.17,44.45 180 top
R30  67.31,49.53 0 top
R31  35.18,11.56 90 top
R32  35.56,34.29 270 top
R33  54.61,7.62 270 top
R34  59.69,7.62 270 top
R-LED1  85.09,1.27 0 top
R-RST  77.47,19.05 0 top
RESET  19.05,76.2 0 top
RESET1  93.98,16.51 0 top
RST  19.68,22.86 0 top
RST1  76.2,57.15 0 top
S3  44.45,39.37 90 top
U1  5.59,10.54 180 bottom
U2  10.16,6.35 0 top
U3  73.66,3.81 0 top
U5  31.75,17.78 270 top
U6  30.23,33.53 180 top
U$1  81.28,67.31 270 top
V  22.23,22.86 0 top
V1  76.2,54.61 0 top
V2  86.36,56.26 0 top
VSS  21.59,76.2 0 top
VSS1  96.52,16.51 0 top

### Tracks (layer width: path | path; a pad name or v marks a point on that pad's centre or on a via)
3.3V  (via drill 0.41)
  Top 0.254: v13.41,20.73 13.72,20.42 v13.72,15.24 | v10.06,4.57 14.33,4.57 U2.18 | 4.88,6.1 4.88,6.4 5.18,6.71 5.79,6.71 U2.4 | 4.88,6.1 4.88,5.18 5.79,5.18 U2.6 | v3.66,6.1 4.88,6.1
  Bottom 0.254: v13.41,20.73 12.8,20.73 12.19,21.34 R2.2 | 14.02,14.94 14.94,14.02 C15.P$1 15.24,13.72 16.15,12.8 19.51,12.8 ANNAREF.2 | 14.02,14.94 v13.72,15.24 | 5.79,11.28 5.79,9.75 U1.4 5.79,9.45 5.79,6.1 | 5.79,11.28 5.79,12.19 U1.2 5.79,11.28 | v10.06,4.57 9.45,5.18 8.53,5.18 C8.1 8.23,5.49 7.62,6.1 5.79,6.1 | J4.UVCC 1.52,6.1 v3.66,6.1 5.79,6.1 | 14.02,14.94 10.67,11.58 7.92,11.58 7.62,11.28 5.79,11.28
84_3.3V
  Top 0.254: 93.88,1.52 93.88,6.1 ANNAREF3.2 | 77.11,8.53 77.11,5.49 78.64,3.96 C12.1 | C13.2 77.11,8.53 | 77.42,17.68 77.11,17.37 77.11,8.53 | 77.42,17.68 78.64,18.9 R-RST.2 | 77.42,17.68 73.46,17.68 72.54,18.59 72.54,18.9 66.14,18.9 U3.1 | 93.88,1.52 88.7,1.52 88.7,9.14 87.78,10.06 3.3VREG.OUT | 93.88,1.52 LED1.A
  Bottom 0.254: C13.2 79.86,11.28 86.56,11.28 87.48,10.36 3.3VREG.OUT
84_CE
  Bottom 0.203: U3.3 66.14,14.02 72.85,20.73 79.86,20.73 82.6,17.98 96.62,17.98 97.54,17.07 97.54,9.14 96.62,9.14 ANNAREF3.3
84_CS  (via drill 0.3)
  Top 0.203: v72.54,10.06 66.14,16.46 U3.2
  Bottom 0.203: v72.54,10.06 74.98,10.06 75.59,9.45 78.03,9.45 78.33,9.14 93.88,9.14 ANNAREF3.4
84_GND
  Top 0.254: 80.47,4.88 78.94,6.4 C12.2 | 80.47,4.88 83.82,1.52 | -.1 91.44,20.12 90.22,18.9 90.22,5.18 JP4.4 | 83.82,1.52 86.26,3.96 86.26,8.23 3.3VREG.GND | 83.82,1.52 R-LED1.1 | 80.47,4.88 80.47,11.58 79.25,12.8 79.25,14.94 78.94,15.24 C13.1
  Bottom 0.254: C11.2 82.91,16.46 80.16,16.46 78.94,15.24 C13.1 77.42,15.24 73.76,18.9 U3.14 | 3.3VREG.GND 86.56,8.23 87.78,7.01 88.09,7.01 89.92,5.18 JP4.4 90.22,5.18 95.4,5.18 96.32,6.1 ANNAREF3.1
84_GPIO1  (via drill 0.3)
  Top 0.203: v79.86,13.11 82.3,15.54 82.3,20.12 JP5.1
  Bottom 0.203: v79.86,13.11 75.29,13.11 73.76,11.58 U3.11
84_GPIO2  (via drill 0.3)
  Top 0.203: v81.08,8.53 82.3,9.75 82.3,14.33 85.04,17.07 85.04,20.12 JP5.2
  Bottom 0.203: v81.08,8.53 78.33,8.53 78.03,8.84 73.76,8.84 U3.10
84_GPIO3
  Top 0.203: U3.6 66.14,6.1 72.54,6.1 72.54,3.35 73.46,2.44 79.86,2.44 79.86,3.96 77.72,6.1 77.72,7.62 79.86,9.75 79.86,11.58 77.72,13.72 77.72,16.76 81.38,20.42 81.38,21.64 81.99,22.25 87.48,22.25 87.48,20.42 JP5.3
84_IRQ  (via drill 0.3)
  Top 0.203: v92.35,14.94 93.88,14.94 93.88,14.02 ANNAREF3.8
  Bottom 0.203: v92.35,14.94 82.91,14.94 82.3,14.33 77.72,14.33 76.81,15.24 72.24,15.24 66.14,9.14 U3.5
84_MISO  (via drill 0.3)
  Top 0.203: v94.49,2.74 95.4,3.66 95.4,12.8 96.32,13.72 ANNAREF3.7
  Bottom 0.203: v94.49,2.74 74.68,2.74 73.76,3.66 U3.8
84_MOSI  (via drill 0.3)
  Top 0.203: v89.61,2.13 92.96,5.49 92.96,10.36 93.88,11.28 ANNAREF3.6
  Bottom 0.203: v89.61,2.13 67.67,2.13 66.14,3.66 U3.7
84_RL1  (via drill 0.3)
  Top 0.203: v76.5,8.23 76.5,13.72 73.76,16.46 U3.13
  Bottom 0.203: v76.5,8.23 77.42,7.32 82.91,7.32 85.04,5.18 JP4.2
84_RL2  (via drill 0.3)
  Top 0.203: v85.34,12.5 86.56,11.28 86.56,9.45 87.48,8.53 87.48,5.18 JP4.3
  Bottom 0.203: v85.34,12.5 83.21,12.5 81.99,13.72 73.76,13.72 U3.12
84_RST
  Bottom 0.203: RESET1.1 93.88,16.76 93.27,17.37 77.72,17.37 76.2,18.9 R-RST.1 76.2,19.2 75.29,20.12 73.15,20.12 72.85,19.81 72.54,19.81 72.54,17.98 66.14,11.58 U3.4
84_SCK  (via drill 0.3)
  Top 0.203: v75.89,10.06 75.89,8.53 73.76,6.4 U3.9
  Bottom 0.203: v75.89,10.06 77.72,11.89 92.96,11.89 93.57,12.5 95.4,12.5 96.32,11.58 ANNAREF3.5
84_VSS
  Top 0.203: VSS1.1 96.32,16.76 95.4,17.68 95.4,20.12 +.1 | C11.1 83.21,13.72 85.04,11.89 85.04,10.36 3.3VREG.IN 85.04,10.06 85.04,7.62 82.6,5.18 JP4.1
  Bottom 0.203: VSS1.1 96.32,16.46 95.1,15.24 93.57,15.24 92.35,14.02 83.21,14.02 C11.1
AD0
  Top 0.203: R20.2 12.8,22.86 15.54,20.12 15.54,8.53 14.63,8.53 U2.23
AD1  (via drill 0.3)
  Top 0.203: v14.33,20.42 14.33,9.14 U2.24 | v6.1,20.42 6.1,19.2 R21.2
  Bottom 0.203: v14.33,20.42 14.02,20.12 6.4,20.12 v6.1,20.42
AD2
  Top 0.203: U2.25 12.8,10.67 12.8,16.15 11.58,17.37 9.14,17.37 9.14,15.24 R22.2
AM_3.3V
  Bottom 0.254: 90.22,58.22 90.22,56.39 91.44,56.39 J8.UVCC | 90.22,58.22 90.22,67.06 89.92,67.36 67.36,67.36 67.36,58.52 66.14,57.3 ANNAREF2.2 | 90.22,58.22 87.78,58.22 86.56,59.44 U$1.21
AM_A3
  Top 0.203: U$1.20 83.82,58.83 86.26,56.39 V2.1
AM_CE
  Top 0.203: ANNAREF2.3 68.58,54.86 67.36,56.08 67.36,60.96 66.14,62.18 U$1.A6
AM_CS
  Top 0.203: ANNAREF2.4 68.58,57.3 69.8,58.52 69.8,60.96 66.14,64.62 U$1.A7
AM_GND  (via drill 0.41)
  Top 0.254: D2.2 84.73,77.42 84.73,76.5 86.26,74.98 U$1.4 | v90.83,72.85 91.44,72.24 U$1.23
  Bottom 0.254: ANNAREF2.1 66.14,54.86 67.06,55.78 85.34,55.78 86.26,54.86 95.1,54.86 96.32,56.08 J8.UGND 96.32,56.39 95.1,57.61 93.27,57.61 91.44,59.44 U$1.23 | v90.83,72.85 86.56,72.85 86.56,74.68 U$1.4
AM_IRQ  (via drill 0.3)
  Top 0.203: v74.37,72.85 74.37,65.84 74.98,65.23 74.98,58.52 73.76,57.3 ANNAREF2.8
  Bottom 0.203: v74.37,72.85 82.6,72.85 83.82,74.07 U$1.5
AM_MISO  (via drill 0.3)
  Top 0.203: v74.68,56.39 74.68,55.78 73.76,54.86 ANNAREF2.7
  Bottom 0.203: v74.68,56.39 74.68,58.22 72.54,58.22 71.32,59.44 U$1.15
AM_MOSI
  Bottom 0.203: ANNAREF2.6 71.02,57.3 68.89,59.44 68.58,59.44 U$1.14
AM_RST
  Top 0.203: U$1.3 89,74.68 89,59.74 U$1.22
  Bottom 0.203: RST1.1 76.2,57.3 77.11,58.22 84.12,58.22 85.04,59.13 85.04,60.96 87.48,60.96 88.7,59.74 U$1.22
AM_SCK
  Top 0.203: ANNAREF2.5 71.32,54.86 72.54,56.08 72.54,58.52 73.46,59.44 U$1.16
AM_VSS
  Top 0.254: V1.1 76.2,54.86 93.88,54.86 93.88,56.08 J8.UVSS 94.18,56.39 94.18,59.44 U$1.24
ARSH_3.3V
  Top 0.254: ANNAREF4.2 JP7.2
ARSH_CE
  Bottom 0.203: ANNAREF4.3 59.44,76.2 59.44,73.46 60.05,72.85 60.05,67.67 59.13,66.75 59.13,60.66 53.34,54.86 JP6.6
ARSH_CS
  Top 0.203: JP6.5 53.34,57.3 58.22,62.18 58.22,73.46 ANNAREF4.4
ARSH_GND
  Bottom 0.254: ANNAREF4.1 59.74,77.42 57.3,77.42 57.3,73.15 57.91,72.54 59.44,72.54 59.44,67.67 59.13,67.36 53.34,67.36 JP6.1
ARSH_IRQ  (via drill 0.3)
  Top 0.203: v58.83,67.97 58.83,61.87 60.96,59.74 JP7.1
  Bottom 0.203: v58.83,67.97 53.34,73.46 ANNAREF4.8
ARSH_MISO
  Top 0.203: ANNAREF4.7 54.56,74.98 54.56,73.46 55.17,72.85 55.17,64.31 53.34,62.48 JP6.3
ARSH_MOSI
  Top 0.203: JP6.4 53.34,59.74 55.78,62.18 55.78,73.46 ANNAREF4.6
ARSH_SCK  (via drill 0.3)
  Top 0.203: v56.39,66.75 57,67.36 57,75.29 56.08,76.2 ANNAREF4.5
  Bottom 0.203: v56.39,66.75 55.17,66.75 53.34,64.92 JP6.2
CE  (via drill 0.3)
  Top 0.203: v13.11,8.84 13.11,5.18 14.33,5.18 U2.19
  Bottom 0.203: v13.11,8.84 19.81,8.84 23.47,12.5 23.47,15.24 ANNAREF.3
CE2
  Bottom 0.203: NRF.3 23.47,68.58 23.47,65.84 21.95,64.31 21.34,64.31 17.68,60.66 9.75,60.66 5.18,56.08 R6.2
COL1
  Top 0.203: R27.1 66.14,46.63 67.67,48.16 71.32,48.16 71.32,39.62 72.85,38.1 LED8.13
COL2
  Bottom 0.203: R28.1 66.14,42.98 66.14,40.23 66.45,40.23 67.67,39.01 67.67,34.44 73.46,34.44 75.59,32.31 86.87,32.31 87.78,33.22 87.78,35.36 96.93,35.36 LED8.3
COL3  (via drill 0.3)
  Top 0.203: v92.96,39.32 92.96,43.28 93.88,44.2 R29.1
  Bottom 0.203: v92.96,39.32 94.18,38.1 LED8.4
COL4
  Bottom 0.203: R30.1 66.14,49.38 67.97,47.55 71.02,47.55 72.85,45.72 LED8.10
COL5  (via drill 0.3)
  Top 0.203: R23.1 67.67,29.57 v67.67,43.89 | v82.91,45.11 83.21,44.81 v83.21,42.98
  Bottom 0.203: v67.67,43.89 68.28,44.5 76.2,44.5 76.81,45.11 v82.91,45.11 | v83.21,42.98 96.93,42.98 LED8.6
COL6  (via drill 0.3)
  Top 0.203: v67.06,40.54 67.06,32.92 66.14,32 R24.1 | v71.93,41.45 72.85,42.37 72.85,42.98 LED8.11
  Bottom 0.203: v67.06,40.54 67.97,41.45 v71.93,41.45
COL7  (via drill 0.3)
  Top 0.203: v69.8,33.83 69.8,44.5 67.36,44.5 67.06,44.2 67.06,42.67 66.45,42.06 66.45,39.93 66.14,39.62 R25.1
  Bottom 0.203: v69.8,33.83 70.41,33.22 72.85,33.22 LED8.15
COL8
  Bottom 0.203: R26.1 66.14,35.36 68.89,32.61 70.71,32.61 72.85,30.48 LED8.16
CS  (via drill 0.3)
  Top 0.203: v16.76,13.41 16.76,7.62 14.63,7.62 U2.22
  Bottom 0.203: v16.76,13.41 18.59,15.24 ANNAREF.4
CSN2
  Bottom 0.203: R7.2 5.18,59.74 6.71,61.27 17.68,61.27 21.34,64.92 21.95,64.92 22.86,65.84 22.86,67.36 20.42,67.36 19.2,68.58 NRF.4
DV_3.3V
  Bottom 0.254: ANNAREF_.2 28.04,59.74 32,63.7 43.59,63.7 46.94,67.06 46.94,72.24 48.16,72.24 JP2.18
DV_CE
  Top 0.203: JP2.15 45.72,68.58 41.76,68.58 38.41,65.23 38.41,55.47 32,55.47 30.48,57 ANNAREF_.3
DV_CS
  Top 0.203: ANNAREF_.4 30.48,59.74 33.22,62.48 33.22,67.67 35.36,69.8 JP2.7
DV_GND
  Top 0.254: JP3.9 48.16,74.68 46.94,73.46 46.94,66.14 44.2,63.4 44.2,57.61 43.89,57.3 D1.2
  Bottom 0.254: D1.2 43.59,57.3 43.59,58.52 29.26,58.52 28.04,57.3 ANNAREF_.1
DV_MISO
  Top 0.203: ANNAREF_.7 35.66,57.3 37.8,59.44 37.8,67.06 40.54,69.8 JP2.11
DV_MOSI
  Top 0.203: ANNAREF_.6 33.22,59.74 33.83,60.35 33.83,66.45 36.88,69.49 36.88,70.41 37.49,71.02 42.98,71.02 42.98,70.1 JP2.13
DV_SCK
  Top 0.203: ANNAREF_.5 33.22,57.3 34.44,58.52 34.44,66.14 38.1,69.8 JP2.9
GND  (via drill 0.41)
  Top 0.254: 1.52,1.22 J4.UGND | 16.76,6.71 14.63,6.71 U2.21 | v16.76,3.35 16.76,6.71 | U2.5 6.1,6.1 7.01,6.1 7.01,7.01 6.71,7.32 6.1,7.32 U2.3 5.79,7.62 v4.27,7.62 | D3.2 1.83,21.64 3.05,21.64 3.05,16.76 1.52,15.24 POWER.2 | 16.76,6.71 17.37,7.32 v17.37,16.46
  Bottom 0.254: C5.1 18.29,2.44 17.68,2.44 v16.76,3.35 14.02,3.35 13.11,2.44 C7.2 12.8,2.44 8.53,2.44 C8.2 8.23,2.13 2.13,2.13 J4.UGND | 13.11,16.46 14.63,17.98 16.46,17.98 C14.P$2 | 13.11,16.46 10.67,14.02 C15.P$2 10.36,14.02 9.75,14.63 1.83,14.63 | 13.11,16.46 v17.37,16.46 20.73,16.46 20.73,15.24 21.95,14.02 21.95,12.8 ANNAREF.1 | C6.1 7.62,21.34 2.13,21.34 1.83,21.64 D3.2 | 1.83,14.63 1.22,15.24 POWER.2 1.83,14.63 | 1.83,14.63 3.96,12.5 U1.1 4.27,12.19 v4.27,7.62
IA  (via drill 0.3)
  Top 0.203: v33.53,9.45 33.53,17.07 35.36,17.07 U5.6
  Bottom 0.203: v33.53,9.45 33.53,2.74 31.7,2.74 30.48,1.52 J6.P6
IB  (via drill 0.3)
  Top 0.203: v32.92,6.4 32.92,18.29 35.36,18.29 U5.7
  Bottom 0.203: v32.92,6.4 28.04,1.52 J6.P5
IRQ  (via drill 0.3)
  Top 0.203: v10.67,15.85 10.67,14.63 7.62,11.58 7.62,10.67 U2.32
  Bottom 0.203: v10.67,15.85 10.97,16.15 12.19,16.15 15.24,19.2 18.59,19.2 19.51,20.12 ANNAREF.8
IRQ2
  Top 0.203: NRF.8 18.9,73.46 17.98,72.54 17.98,55.47 17.07,54.56 K3.1
ISP_GND
  Top 0.203: R8.1 2.74,63.7 2.74,67.06 R9.1 2.74,67.36 2.74,68.89 4.88,71.02 LED3.K 5.18,71.32 5.18,76.2 LED4.K
  Bottom 0.203: NRF.1 21.34,66.14 20.73,66.75 19.81,66.75 19.2,67.36 14.02,67.36 12.8,68.58 ISP1.6 12.5,68.58 11.89,69.19 11.28,69.19 10.67,69.8 6.4,69.8 LED3.K
ISP_MISO
  Bottom 0.203: ISP1.1 11.28,72.54 20.42,72.54 21.34,73.46 NRF.7
ISP_MOSI
  Bottom 0.203: NRF.6 18.9,71.32 12.8,71.32 ISP1.4
ISP_RST
  Top 0.203: RESET.1 11.28,76.2 11.28,69.49 10.36,68.58 ISP1.5 10.06,68.58 10.06,56.39 8.23,54.56 K2.1
ISP_SCK
  Bottom 0.203: NRF.5 21.34,71.02 20.12,69.8 11.58,69.8 10.36,71.02 ISP1.3
ISP_VCC
  Bottom 0.203: ISP1.2 13.72,74.68 19.81,74.68 21.34,76.2 VSS.1
LD1
  Top 0.203: R16.2 60.96,34.44 59.74,35.66 59.74,48.16 60.96,49.38 J2.P3~
LD2
  Top 0.203: J2.P5 R17.2
LD3
  Top 0.203: R18.2 56.08,31.39 56.08,28.04 J2.P6
LD5
  Top 0.203: J7.P5 53.34,4.88 54.56,6.1 R33.2
LD6
  Top 0.203: R34.2 56.08,2.74 56.08,1.52 J7.P6
MDC_GND
  Top 0.203: R31.1 35.05,10.06 33.53,8.53 33.53,6.1 32,4.57 28.96,4.57 28.96,8.23 28.04,9.14 28.04,11.28 JP10.2
  Bottom 0.203: J6.UGND 28.04,22.86 28.04,11.58 JP10.2
MDC_SENSE
  Top 0.203: R31.2 35.36,13.11 35.36,15.85 U5.5 35.66,15.85 36.58,16.76 | 36.58,16.76 36.58,19.51 35.66,19.51 U5.8 | 36.58,16.76 36.58,2.44 35.66,1.52 J6.A4
MDC_VCC
  Top 0.203: U5.2 28.04,18.29 28.04,17.37 U5.3 28.35,17.07 30.48,17.07 JP10.1
MISO
  Top 0.203: U2.16 13.11,1.83 14.02,1.83 15.24,0.61 21.64,0.61 21.64,10.67 23.47,12.5 23.47,18.9 22.25,20.12 ANNAREF.7
MK_VCC
  Top 0.203: R10.2 48.16,32 48.16,46.94 45.72,49.38 J3.UVCC
MOSI
  Top 0.203: U2.15 12.19,2.13 12.19,2.74 12.5,3.05 13.41,3.05 15.24,1.22 18.59,1.22 18.59,16.76 19.51,17.68 ANNAREF.6
MX_CLOCK  (via drill 0.3)
  Top 0.203: JP8.5 81.38,30.48 81.38,33.53 IC1.11 81.38,33.83 81.38,39.01 v81.69,39.32 | v81.38,43.28 81.38,46.94 JP9.5
  Bottom 0.203: v81.38,43.28 82.3,42.37 82.3,39.32 v81.69,39.32
MX_DATA
  Top 0.203: IC1.14 88.7,33.83 87.48,35.05 87.48,44.81 86.56,45.72 86.56,46.94 JP9.9
MX_DATAOUT  (via drill 0.3)
  Top 0.203: v76.5,31.7 76.5,33.22 76.2,33.53 IC1.9
  Bottom 0.203: v76.5,31.7 85.04,31.7 86.26,30.48 JP8.9
MX_GND  (via drill 0.3)
  Top 0.203: JP9.3 78.64,46.94 v78.64,43.89 79.86,42.67 79.86,34.75 | 79.86,34.75 v80.47,35.36 | 79.86,34.75 79.86,31.39 78.94,30.48 JP8.3
  Bottom 0.203: v78.64,43.89 76.2,41.45 IC1.8 | v80.47,35.36 84.73,35.36 86.26,33.83 IC1.13
MX_LATCH
  Top 0.203: JP8.7 IC1.12 83.82,33.83 84.73,34.75 84.73,42.37 84.43,42.67 84.43,46.33 83.82,46.94 JP9.7
MX_VCC  (via drill 0.3)
  Top 0.203: JP8.1 77.11,31.39 v77.11,35.05 77.11,46.02 76.2,46.94 JP9.1 | v93.57,35.97 93.57,34.14 93.88,33.83 IC1.16
  Bottom 0.203: 78.33,34.14 77.42,35.05 v77.11,35.05 | 78.33,34.14 78.64,33.83 IC1.10 78.33,34.14 | v93.57,35.97 80.16,35.97 78.33,34.14
N$1  (via drill 0.3)
  Top 0.203: v15.54,5.79 14.63,5.79 U2.20
  Bottom 0.203: v15.54,5.79 15.24,5.49 13.11,5.49 C7.1
N$2  (via drill 0.3)
  Top 0.203: U2.7 6.1,4.57 7.62,4.57 v7.62,7.01 7.62,8.84 6.71,9.75 6.71,11.28 7.32,11.89 7.32,14.94 v7.62,15.24
  Bottom 0.203: 7.62,18.9 C6.2 v7.62,15.24 | v7.62,7.01 10.67,10.06 Q1.2
N$3  (via drill 0.3)
  Top 0.203: v31.7,10.06 31.7,19.51 28.35,19.51 U5.1
  Bottom 0.203: v31.7,10.06 28.04,6.4 JP11.1
N$4  (via drill 0.3)
  Top 0.203: 10.97,7.01 12.5,8.53 v12.5,9.45 | 10.97,7.01 8.53,4.57 8.53,3.66 6.1,3.66 U2.8 | 10.97,7.01 v11.58,6.4
  Bottom 0.203: 18.59,5.18 C5.2 18.29,5.49 17.37,6.4 v11.58,6.4 | v12.5,9.45 13.11,10.06 14.94,10.06 Q1.1
N$5
  Top 0.203: JP11.2 30.48,7.32 29.26,8.53 29.26,14.94 28.35,15.85 U5.4
N$6  (via drill 0.3)
  Top 0.203: v89.61,66.75 90.22,67.36 90.22,76.5 89,77.72 J8.A4
  Bottom 0.203: v89.61,66.75 86.87,66.75 82.91,62.79 U$1.A4
N$7  (via drill 0.3)
  Top 0.203: v88.39,73.46 88.39,65.84 85.34,62.79 U$1.A5
  Bottom 0.203: v88.39,73.46 89.31,73.46 90.22,74.37 90.22,77.72 91.44,77.72 J8.A5
N$8
  Bottom 0.203: K3.4 15.54,63.7 8.53,63.7 5.18,67.06 R9.2
N$9
  Bottom 0.203: R8.2 6.1,62.48 7.92,62.48 K2.4
N$10
  Top 0.203: LED3.A 1.52,70.1 1.52,57 2.44,56.08 R6.1
N$11
  Bottom 0.203: LED4.A 3.66,76.2 3.66,63.09 3.05,62.48 2.74,62.48 2.74,59.74 R7.1
N$12
  Top 0.203: D1.4 41.15,57.3 39.62,58.83 39.62,62.18 R1.1
N$13
  Top 0.203: D1.3 42.67,57.3 42.98,57.61 42.98,62.18 R3.1
N$14
  Top 0.203: D1.1 45.11,57.3 46.94,59.13 46.94,62.18 R14.1
N$15
  Top 0.203: R14.2 47.24,64.92 48.16,65.84 48.16,69.8 JP2.17
N$16
  Top 0.203: S3.P$1 41.76,35.36 41.76,32.92 40.84,32 R10.1 40.84,31.7 40.84,30.18 42.98,28.04 J3.P6
N$18
  Top 0.203: S3.P$3 46.94,35.66 46.94,42.98 S3.P$4 46.94,43.28 40.84,49.38 J3.UGND
N$19
  Top 0.203: R13.2 44.2,9.14 43.28,10.06 43.28,15.54 44.2,16.46 R12.2 44.5,16.76 45.72,17.98 J1.UVCC
  Bottom 0.203: J1.UVCC 44.5,21.64 43.28,21.64 40.84,19.2 JP1.1
N$20
  Top 0.203: JP1.3 40.84,14.02 42.06,15.24 42.06,21.64 40.84,22.86 J1.UGND
N$21
  Top 0.203: J1.A5 45.72,7.92 | 45.72,7.92 45.72,12.5 44.5,13.72 R12.1 | 45.72,7.92 43.28,7.92 43.28,8.84 40.84,11.28 JP1.4
N$22
  Top 0.203: R13.1 44.2,6.4 41.76,8.84 40.84,8.84 JP1.5
  Bottom 0.203: J1.A4 48.16,1.52 40.84,8.84 JP1.5
N$23
  Top 0.203: D2.4 81.69,77.72 78.94,77.72 R4.2
N$24
  Top 0.203: U$1.17 76.2,64.62 74.98,65.84 74.98,76.2 76.2,77.42 R4.1
N$25
  Bottom 0.203: D2.3 82.91,77.42 82.91,75.89 82.6,75.59 82.6,73.46 75.89,73.46 74.98,74.37 74.98,77.42 73.76,77.42 R5.2
N$26
  Bottom 0.203: R3.2 42.98,64.92 39.32,68.58 31.7,68.58 30.48,69.8 JP2.3
N$27
  Bottom 0.203: R1.2 39.32,64.92 36.27,67.97 29.87,67.97 28.04,69.8 JP2.1
N$29  (via drill 0.3)
  Top 0.203: v70.41,31.39 70.41,44.5 68.58,46.33 R27.2
  Bottom 0.203: v70.41,31.39 72.54,29.26 86.87,29.26 87.78,30.18 87.78,32.31 90.22,32.31 91.44,33.53 IC1.15
N$30
  Bottom 0.203: IC1.1 93.88,41.15 91.44,38.71 81.38,38.71 80.16,39.93 75.59,39.93 73.46,42.06 69.49,42.06 68.58,42.98 R28.2
N$31  (via drill 0.3)
  Top 0.203: v91.14,44.2 91.44,43.89 IC1.2
  Bottom 0.203: v91.14,44.2 86.56,44.2 R29.2
N$32  (via drill 0.3)
  Top 0.203: v73.76,71.63 73.76,74.68 U$1.9
  Bottom 0.203: v73.76,71.63 90.53,71.63 92.66,73.76 92.66,77.72 93.88,77.72 J8.P6
N$33  (via drill 0.3)
  Top 0.203: v76.81,71.02 76.81,74.07 76.2,74.68 U$1.8
  Bottom 0.203: v76.81,71.02 92.05,71.02 96.32,75.29 96.32,77.72 J8.P5
N$34  (via drill 0.3)
  Top 0.203: v85.65,48.46 87.78,48.46 87.78,45.11 88.7,44.2 88.7,41.45 IC1.3
  Bottom 0.203: v85.65,48.46 75.59,48.46 74.68,49.38 68.58,49.38 R30.2
N$35
  Top 0.203: J8.P3~ 88.7,56.39 86.87,58.22 85.04,58.22 85.04,60.35 84.12,61.27 81.38,61.27 81.38,74.68 U$1.6
N$36  (via drill 0.3)
  Top 0.203: v70.71,29.57 71.93,30.79 71.93,35.97 72.85,36.88 74.37,36.88 v74.37,37.49 | v85.95,38.1 86.26,38.41 86.26,41.15 IC1.4
  Bottom 0.203: v70.71,29.57 70.1,29.57 68.58,28.04 R23.2 | v74.37,37.49 74.98,38.1 v85.95,38.1
N$37  (via drill 0.3)
  Top 0.203: v74.37,36.27 74.37,28.04 70.41,28.04 70.1,28.35 70.1,30.18 68.58,31.7 R24.2 | v82.91,37.19 83.82,38.1 IC1.5
  Bottom 0.203: v74.37,36.27 79.86,36.27 80.77,37.19 v82.91,37.19
N$38  (via drill 0.3)
  Top 0.203: v80.47,38.71 81.08,39.32 81.08,41.15 IC1.6
  Bottom 0.203: v80.47,38.71 79.86,39.32 68.58,39.32 R25.2
N$39
  Top 0.203: R5.1 71.32,77.72 72.54,77.72 73.15,78.33 77.42,78.33 77.42,60.96 78.64,59.74 U$1.18
N$40
  Bottom 0.203: D2.1 85.65,77.42 85.65,76.2 85.04,75.59 85.04,72.24 71.93,72.24 69.8,74.37 69.8,77.42 68.58,77.42 R15.2
N$42
  Top 0.203: R20.1 1.83,22.86 D3.1
N$43
  Top 0.203: R19.2 58.52,31.39 58.52,28.04 J2.A5
N$47  (via drill 0.3)
  Top 0.203: v78.33,36.88 78.64,37.19 78.64,41.15 IC1.7
  Bottom 0.203: v78.33,36.88 72.85,36.88 71.93,35.97 68.89,35.97 68.58,35.66 R26.2
N$50  (via drill 0.3)
  Top 0.203: v73.76,66.75 67.36,73.15 67.36,76.2 66.14,77.42 R15.1
  Bottom 0.203: v73.76,66.75 80.77,59.74 81.08,59.74 U$1.19
N$51
  Bottom 0.203: R-LED1.2 86.56,1.52 92.96,1.52 93.57,2.13 95.71,2.13 96.32,1.52 LED1.K
N$56
  Top 0.203: R33.1 54.86,9.14 54.86,15.24 LED5.A
N$57
  Top 0.203: R34.1 59.74,9.14 59.74,15.24 LED6.A
N$62  (via drill 0.3)
  Top 0.203: v60.96,35.97 LED9.A | R16.1 v60.96,32.92
  Bottom 0.203: v60.96,32.92 v60.96,35.97
N$63
  Top 0.203: R17.1 LED10.A
N$64
  Top 0.203: LED11.A 55.78,39.93 55.78,34.44 R18.1
N$65
  Top 0.203: LED12.A 58.52,39.93 58.52,34.44 R19.1
N$66  (via drill 0.3)
  Top 0.203: v5.18,20.73 5.18,21.03 7.01,21.03 8.84,19.2 R21.1
  Bottom 0.203: v5.18,20.73 1.83,20.73 D3.3
N$67  (via drill 0.3)
  Top 0.203: v5.18,16.76 5.18,16.15 6.1,15.24 R22.1
  Bottom 0.203: v5.18,16.76 3.05,18.9 1.83,18.9 D3.4
N$68  (via drill 0.3)
  Top 0.203: 53.34,43.89 55.78,43.89 LED11.C 56.08,43.89 58.22,43.89 LED12.C | v60.35,45.11 60.35,44.5 60.96,43.89 LED9.C | J2.UGND 53.34,43.89 | 53.34,43.89 LED10.C
  Bottom 0.203: v60.35,45.11 57.3,48.16 54.56,48.16 53.34,49.38 J2.UGND
N$77
  Top 0.203: J5.A4 35.66,28.04 35.66,32.61 R32.2 35.36,32.92 34.14,34.14 34.14,36.27 31.39,39.01 31.39,44.2 35.36,44.2 JP12.3
PIN3  (via drill 0.3)
  Top 0.203: v3.35,9.14 5.79,9.14 U2.1
  Bottom 0.203: v3.35,9.14 1.52,9.14 J4.P3~
PIN5  (via drill 0.3)
  Top 0.203: v7.62,0.91 7.62,1.83 U2.9
  Bottom 0.203: v7.62,0.91 7.92,1.22 22.86,1.22 J4.P5
PIN6  (via drill 0.3)
  Top 0.203: v9.45,3.96 8.23,2.74 8.23,2.13 U2.10
  Bottom 0.203: v9.45,3.96 22.86,3.96 J4.P6
PWM1
  Bottom 0.203: J5.P5 29.26,29.26 35.36,29.26 35.36,39.32 JP12.1
RESET  (via drill 0.3)
  Top 0.203: v11.28,16.76 11.28,14.63 9.75,13.11 9.75,10.67 U2.29 | v16.46,19.81 19.51,22.86 RST.1
  Bottom 0.203: v11.28,16.76 11.28,18.59 11.89,18.59 R2.1 12.19,18.9 13.41,18.9 14.33,19.81 v16.46,19.81
ROW1
  Top 0.203: 74.07,47.24 73.15,48.16 LED8.9 | 74.07,47.24 74.98,46.33 74.98,29.26 76.2,28.04 JP8.2 | 74.07,47.24 76.2,49.38 JP9.2
ROW2  (via drill 0.3)
  Top 0.203: JP8.4 77.72,28.96 v77.72,35.66 77.72,48.46 78.64,49.38 JP9.4
  Bottom 0.203: v77.72,35.66 73.15,35.66 LED8.14
ROW3  (via drill 0.3)
  Top 0.203: JP8.6 82.3,28.96 v82.3,43.59 82.3,48.46 81.38,49.38 JP9.6
  Bottom 0.203: v82.3,43.59 91.75,43.59 93.57,45.41 94.18,45.41 96.93,48.16 LED8.8
ROW4  (via drill 0.3)
  Top 0.203: 85.34,44.5 85.34,47.85 83.82,49.38 JP9.8 | 85.34,44.5 85.34,29.57 83.82,28.04 JP8.8 | v74.37,42.06 73.15,40.84 LED8.12 | 85.34,44.5 v85.04,44.5
  Bottom 0.203: v74.37,42.06 76.81,44.5 v85.04,44.5
ROW5  (via drill 0.3)
  Top 0.203: v91.14,45.72 92.35,44.5 92.35,35.36 92.96,34.75 v92.96,31.7
  Bottom 0.203: JP8.10 86.56,28.04 87.78,29.26 91.75,29.26 92.96,30.48 v92.96,31.7 95.71,31.7 96.93,30.48 LED8.1 | v91.14,45.72 87.78,45.72 87.78,48.16 86.56,49.38 JP9.10
ROW6  (via drill 0.3)
  Top 0.203: JP8.12 89.92,28.96 89.92,48.16 | 89.92,48.16 89.92,48.46 89,49.38 JP9.12 | v95.71,47.85 95.71,46.94 96.93,45.72 LED8.7 | 89.92,48.16 v93.27,48.16
  Bottom 0.203: v95.71,47.85 95.4,48.16 v93.27,48.16
ROW7  (via drill 0.3)
  Top 0.203: v95.71,29.26 95.71,31.7 96.93,32.92 LED8.2 | v90.53,45.11 90.53,36.58 92.35,34.75 92.35,31.09 92.66,30.79 92.66,29.26 91.44,28.04 JP8.14
  Bottom 0.203: v95.71,29.26 92.66,29.26 91.44,28.04 JP8.14 | v90.53,45.11 92.66,45.11 92.66,48.16 91.44,49.38 JP9.14
ROW8
  Top 0.203: 95.1,38.71 95.1,28.96 94.18,28.04 JP8.16 | 95.1,38.71 96.93,40.54 LED8.5 | 95.1,38.71 95.1,48.46 94.18,49.38 JP9.16
SCK
  Top 0.203: U2.17 14.63,3.35 16.15,1.83 17.98,1.83 17.98,17.68 19.2,18.9 21.95,18.9 21.95,17.98 ANNAREF.5
SCL  (via drill 0.3)
  Top 0.203: v10.67,8.53 10.67,10.36 U2.28
  Bottom 0.203: v10.67,8.53 12.19,7.01 22.25,7.01 22.86,6.4 J4.A5
SDA  (via drill 0.3)
  Top 0.203: v11.58,8.53 11.58,10.36 U2.27
  Bottom 0.203: v11.58,8.53 11.89,8.23 22.25,8.23 22.86,8.84 J4.A4
SM_5V  (via drill 0.3)
  Top 0.203: v29.57,39.01 28.04,40.54 U6.3
  Bottom 0.203: 31.09,37.49 35.36,41.76 JP12.2 | 31.09,37.49 30.48,36.88 C2.P$1 | 31.09,37.49 v29.57,39.01
SM_GND  (via drill 0.3)
  Top 0.203: v34.75,34.44 34.75,35.05 35.36,35.66 R32.1 | U6.4 30.18,33.53 30.18,47.24 28.04,49.38 J5.UGND
  Bottom 0.203: v34.75,34.44 32.31,32 30.48,32 | J5.UGND 27.74,49.38 27.43,49.38 27.43,44.2 30.48,41.15 C1.P$2 30.48,40.84 27.13,40.84 27.13,35.36 30.48,32 | 30.48,32 C2.P$2
SM_VSS  (via drill 0.41)
  Top 0.254: v32.31,43.59 32.31,40.84 U6.1
  Bottom 0.254: J5.UVSS C1.P$1 30.48,45.41 v32.31,43.59
USLED_GND
  Top 0.203: LED6.K 59.44,17.68 54.86,17.68 LED5.K 54.56,17.98 54.56,21.64 J7.UGND
VSS  (via drill 0.41)
  Top 0.254: 2.74,13.72 1.52,13.72 1.52,12.8 POWER.1 | 2.74,13.72 v3.66,13.72 3.66,21.03 v4.88,22.25 | 2.74,13.72 2.74,5.18 1.52,3.96 J4.UVSS
  Bottom 0.254: V.1 21.95,22.86 20.73,21.64 17.68,21.64 16.76,22.55 C14.P$1 16.46,22.55 5.18,22.55 v4.88,22.25 | v3.66,13.72 7.01,13.72 7.01,12.5 U1.3

### Text on the board
tNames: GND | SCK | 3.3V | MISO | MOSI | CS | IRQ | CE
tDocu: ISP | - | nRF24L01 | nRF24L01 | Arduino Pro Mini / Generic Smarty | R_Keys | nRF24L01 | nRF24L01 | R_LEDs | LEDs uShield | Servos uShield | Button uShield | Dual Relay Smarty | 11 | 10 | 6 | + | - | nRF24L01 | - | + | + | + | - | IMU uShield | LEDs uShield | DC Motor / uShield | + | P1 | P2 | GND
bDocu: S | S | RoboTal / Generic / Smartie | v1.0